# Altium project MCXE31B.PrjPcb (part 2 of 2)

## Sheet 09 ETHERNET_ENET.SchDoc
size 513 x 386 mm
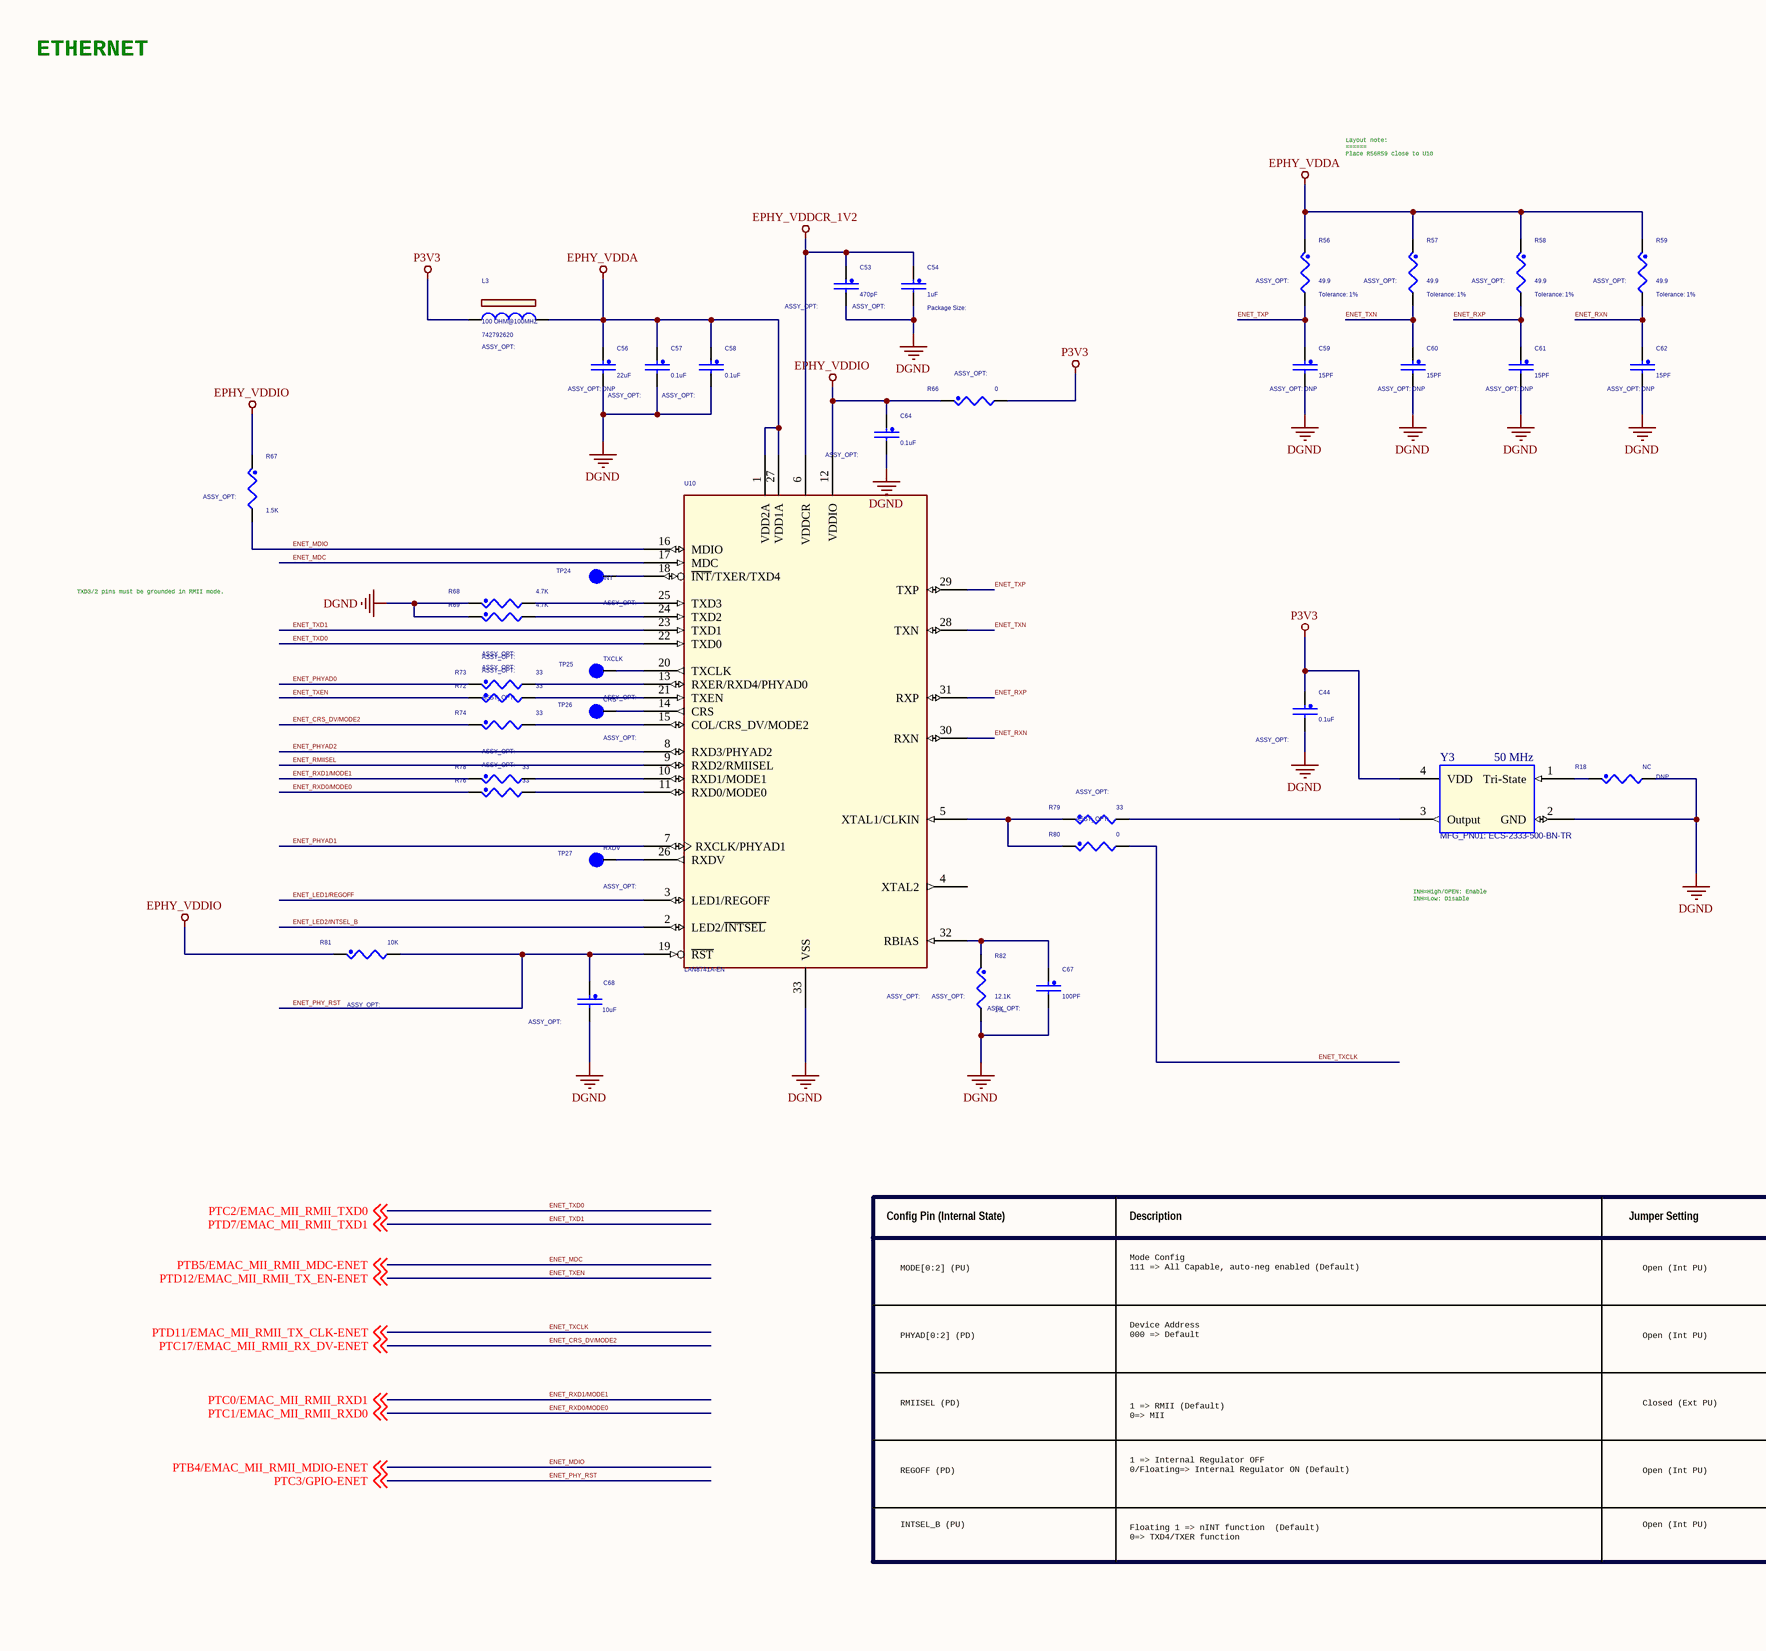
[diagram p10: 09 ETHERNET_ENET.SchDoc, left]
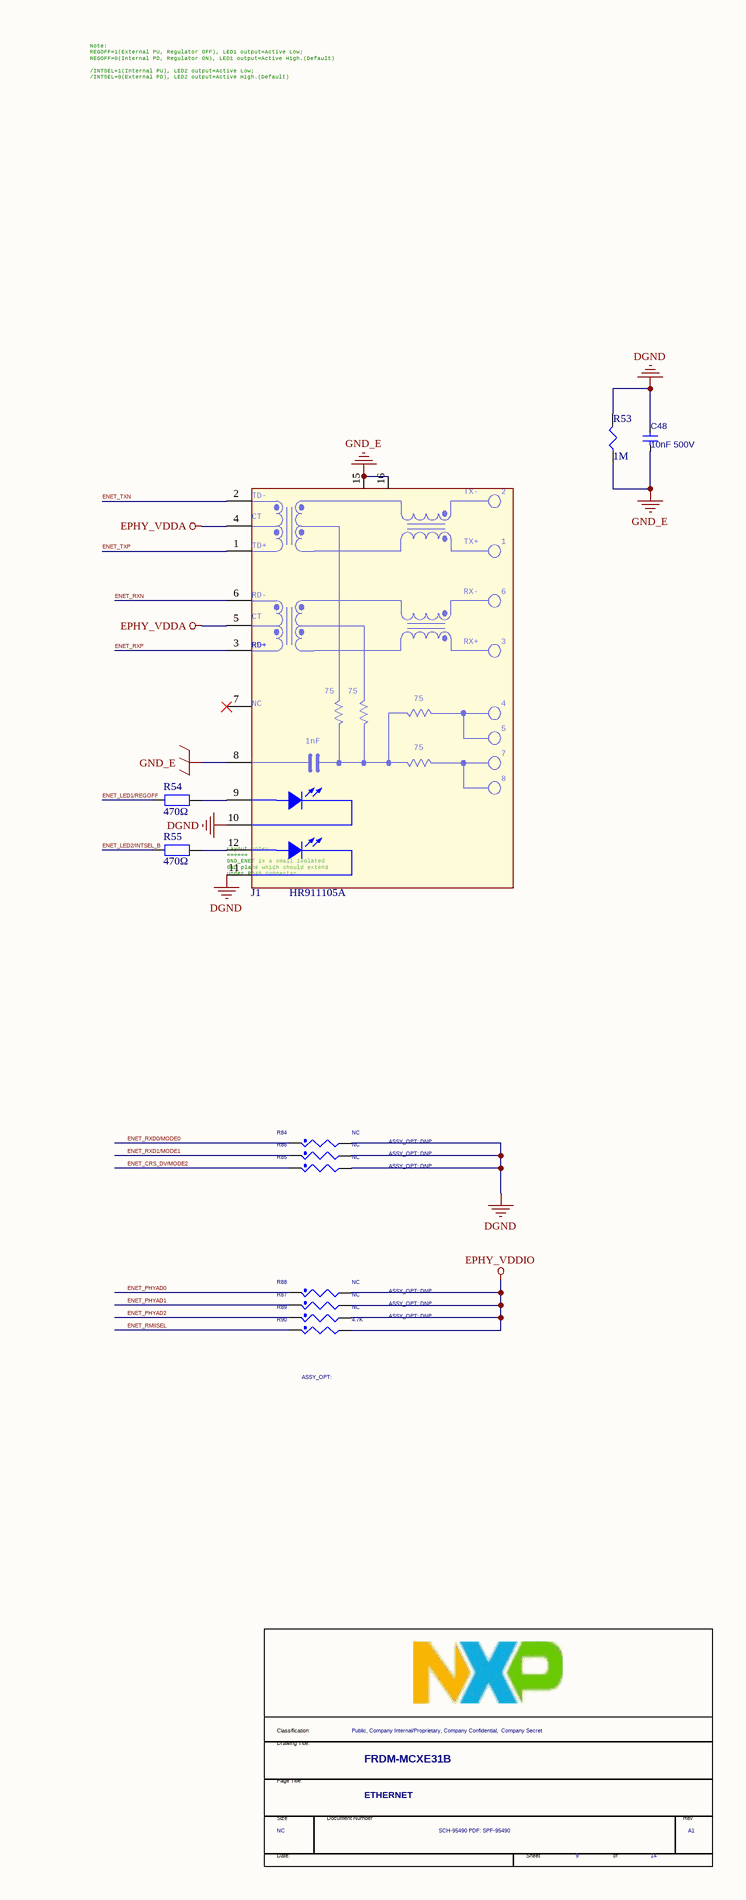
[diagram p11: 09 ETHERNET_ENET.SchDoc, right]

### Parts
(Parts that share a designator on the sheet are numbered #1, #2 ... from top to bottom, then left to right.)
*#7  Title: FRDM-MCXE31B  RevCode: A1  PageTitle: ETHERNET  Page Size: NC  Page Number: 9  Page Count: 14  Doc: SCH-95490 PDF: SPF-95490  Classification: Public, Company Internal/Proprietary, Company Confidential,  Company Secret  (hidden comment: TitleBlock_FS)  (graphical)
C44  0.1uF  [CC0402_25]
C48  10nF 500V  [1210]
C53  470pF  [CC0402_25]
C54  1uF  [CC0402_25]
C56  22uF  ASSY_OPT: DNP  [CC0603_OV]
C57  0.1uF  [CC0402_25]
C58  0.1uF  [CC0402_25]
C59  15PF  ASSY_OPT: DNP  [CC0402_25]
C60  15PF  ASSY_OPT: DNP  [CC0402_25]
C61  15PF  ASSY_OPT: DNP  [CC0402_25]
C62  15PF  ASSY_OPT: DNP  [CC0402_25]
C64  0.1uF  [CC0402_25]
C67  100PF  [CC0402_25]
C68  10uF  [CC0402_25]
J1  HR911105A  [RJ45-HR911105A]
L3  100 OHM@100MHZ  MFG_PN01: 742792620  [L 0603_L]
R18  NC  ASSY_OPT: DNP  [RC0402_25]
R53  1M  [1210]
R54  470Ω  [R0603]
R55  470Ω  [R0603]
R56  49.9  Tolerance: 1%  [RC0402_25]
R57  49.9  Tolerance: 1%  [RC0402_25]
R58  49.9  Tolerance: 1%  [RC0402_25]
R59  49.9  Tolerance: 1%  [RC0402_25]
R66  0  [RC0603_OV]
R67  1.5K  [RC0402_25]
R68  4.7K  [RC0402_25]
R69  4.7K  [RC0402_25]
R72  33  [RC0402_25]
R73  33  [RC0402_25]
R74  33  [RC0402_25]
R76  33  [RC0402_25]
R78  33  [RC0402_25]
R79  33  [RC0402_25]
R80  0  [RC0402_25]
R81  10K  [RC0402_25]
R82  12.1K  Tolerance: 1%  [RC0402_25]
R84  NC  ASSY_OPT: DNP  [RC0402_25]
R85  NC  ASSY_OPT: DNP  [RC0402_25]
R86  NC  ASSY_OPT: DNP  [RC0402_25]
R87  NC  ASSY_OPT: DNP  [RC0402_25]
R88  NC  ASSY_OPT: DNP  [RC0402_25]
R89  NC  ASSY_OPT: DNP  [RC0402_25]
R90  4.7K  [RC0402_25]
TP24  SILK: INT  [TPAD_030]  (hidden comment: TPAD_030)
TP25  SILK: TXCLK  [TPAD_030]  (hidden comment: TPAD_030)
TP26  SILK: CRS  [TPAD_030]  (hidden comment: TPAD_030)
TP27  SILK: RXDV  [TPAD_030]  (hidden comment: TPAD_030)
U10  LAN8741A-EN  [QFN-32-EP(5x5)]
Y3  50 MHz  MFG_PN01: ECS-2333-500-BN-TR  [OSC-SMD_4P-L3.2-W2.5-BL]

### Nets
DGND: C44.2 C48.2 C53.2 C54.2 C56.2 C57.2 C58.2 C59.2 C60.2 C61.2 C62.2 C64.2 C67.2 C68.2 J1.10(CATHODE) J1.11(CATHODE) R18.2 R53.2 R68.1 R69.1 R82.2 R84.2 R85.2 R86.2 U10.33(VSS) Y3.2(GND)
EPHY_VDDA: C56.1 C57.1 C58.1 J1.4(P4) J1.5(P5) L3.2 R56.1 R57.1 R58.1 R59.1 U10.1(VDD2A) U10.27(VDD1A)
EPHY_VDDCR_1V2: C53.1 C54.1 U10.6(VDDCR)
EPHY_VDDIO: C64.1 R66.1 R67.1 R81.1 R87.2 R88.2 R89.2 R90.2 U10.12(VDDIO)
GND_E: C48.1 J1.8(P8) J1.15(P15) J1.16(P16) R53.1
P3V3: C44.1 L3.1 R66.2 Y3.4(VDD)
ENET_CRS_DV/MODE2: R74.1 R85.1 ; off-sheet PTC17/EMAC_MII_RMII_RX_DV-ENET  [also labelled PTC17/EMAC_MII_RMII_RX_DV-ENET]
ENET_LED1/REGOFF: R54.2 U10.3(LED1/REGOFF)
ENET_LED2/INTSEL_B: R55.2 U10.2(LED2/~{INTSEL})
ENET_MDC: U10.17(MDC) ; off-sheet PTB5/EMAC_MII_RMII_MDC-ENET  [also labelled PTB5/EMAC_MII_RMII_MDC-ENET]
ENET_MDIO: R67.2 U10.16(MDIO) ; off-sheet PTB4/EMAC_MII_RMII_MDIO-ENET  [also labelled PTB4/EMAC_MII_RMII_MDIO-ENET]
ENET_PHY_RST: C68.1 R81.2 U10.19(~{RST}) ; off-sheet PTC3/GPIO-ENET  [also labelled PTC3/GPIO-ENET]
ENET_PHYAD0: R73.1 R88.1
ENET_PHYAD1: R87.1 U10.7(RXCLK/PHYAD1)
ENET_PHYAD2: R89.1 U10.8(RXD3/PHYAD2)
ENET_RMIISEL: R90.1 U10.9(RXD2/RMIISEL)
ENET_RXD0/MODE0: R76.1 R84.1 ; off-sheet PTC1/EMAC_MII_RMII_RXD0  [also labelled PTC1/EMAC_MII_RMII_RXD0]
ENET_RXD1/MODE1: R78.1 R86.1 ; off-sheet PTC0/EMAC_MII_RMII_RXD1  [also labelled PTC0/EMAC_MII_RMII_RXD1]
ENET_RXN: C62.1 J1.6(P6) R59.2 U10.30(RXN)
ENET_RXP: C61.1 J1.3(P3) R58.2 U10.31(RXP)
ENET_TXCLK: R80.2 ; off-sheet PTD11/EMAC_MII_RMII_TX_CLK-ENET  [also labelled PTD11/EMAC_MII_RMII_TX_CLK-ENET]
ENET_TXD0: U10.22(TXD0) ; off-sheet PTC2/EMAC_MII_RMII_TXD0  [also labelled PTC2/EMAC_MII_RMII_TXD0]
ENET_TXD1: U10.23(TXD1) ; off-sheet PTD7/EMAC_MII_RMII_TXD1  [also labelled PTD7/EMAC_MII_RMII_TXD1]
ENET_TXEN: R72.1 ; off-sheet PTD12/EMAC_MII_RMII_TX_EN-ENET  [also labelled PTD12/EMAC_MII_RMII_TX_EN-ENET]
ENET_TXN: C60.1 J1.2(P2) R57.2 U10.28(TXN)
ENET_TXP: C59.1 J1.1(P1) R56.2 U10.29(TXP)
NetC67_1: C67.1 R82.1 U10.32(RBIAS)
NetJ1_9: J1.9(ANODE) R54.1
NetJ1_12: J1.12(ANODE) R55.1
NetR18_1: R18.1 Y3.1(Tri-State)
NetR68_2: R68.2 U10.25(TXD3)
NetR69_2: R69.2 U10.24(TXD2)
NetR72_2: R72.2 U10.21(TXEN)
NetR73_2: R73.2 U10.13(RXER/RXD4/PHYAD0)
NetR74_2: R74.2 U10.15(COL/CRS_DV/MODE2)
NetR76_2: R76.2 U10.11(RXD0/MODE0)
NetR78_2: R78.2 U10.10(RXD1/MODE1)
NetR79_1: R79.1 R80.1 U10.5(XTAL1/CLKIN)
NetR79_2: R79.2 Y3.3(Output)
NetTP24_1: TP24.1(Pin1) U10.18(~{INT}/TXER/TXD4)
NetTP25_1: TP25.1(Pin1) U10.20(TXCLK)
NetTP26_1: TP26.1(Pin1) U10.14(CRS)
NetTP27_1: TP27.1(Pin1) U10.26(RXDV)

Not connected (* = marked no-connect by the designer): J1 7(P7)*; U10 4(XTAL2)

### Notes on the sheet
- ETHERNET
- Layout note:
  ======
  Place R56R59 close to U10
- Note:
  REGOFF=1(External PU, Regulator OFF), LED1 output=Active Low;
  REGOFF=0(Internal PD, Regulator ON), LED1 output=Active High.(Default)
  /INTSEL=1(Internal PU), LED2 output=Active Low;
  /INTSEL=0(External PD), LED2 output=Active High.(Default)
- TXD3/2 pins must be grounded in RMII mode.
- INH=High/OPEN: Enable
  INH=Low: Disable
- (near J1) Layout note:
  ======
  GND_ENET is a small isolated
  GND plane which should extend
  under RJ45 connector
- Config Pin (Internal State)
- Description
- Jumper Setting
- MODE[0:2] (PU)
- Mode Config
  111 => All Capable, auto-neg enabled (Default)
- Open (Int PU)
- PHYAD[0:2] (PD)
- Device Address
  000 => Default
- RMIISEL (PD)
- 1 => RMII (Default)
  0=> MII
- Closed (Ext PU)
- REGOFF (PD)
- 1 => Internal Regulator OFF
  0/Floating=> Internal Regulator ON (Default)
- INTSEL_B (PU)
- Floating 1 => nINT function  (Default)
  0=> TXD4/TXER function
- (in symbol HR911105A) TX-; TD-; CT; TX+; TD+; RX-; RD-; RX+; RD+; 75; NC; 1nF
- (in symbol TitleBlock_FS) Classification:; Drawing Title:; Page Title:; Size; Document Number; Rev; Date:; Sheet; of

### Library data of the parts
*#7 = TitleBlock_FS: as *#4 on sheet 06 MCU_PORT; Page Create Date: March  8, 1995
C44 C57 C58 C64 = CAP_NP: CAP CER 0.1UF 16V 10% X7R 0402; CLASS: DISCRETE; Temp Range: -55C to +125C; SIGNAL_MODEL: DEFAULT_CAPACITOR_100000pF_2_1; AGILE_PN: 150-75182; MFG_NAME01: Samsung Electro-Mechanics; MFG_PN01: CL05B104KO5NNNC; CAD_APPROVED: Yes; FPLIST: CC0402_25,CC0402_HD,0402_CC,CAPC0402_L,cc0402_lamp3; Temp_Range: -55癈 to +85癈; 3D_Mechanical_Footprint_File: http://fcl.am.freescale.net/ALLEGRO/step/cc0402_25.STEP; Rated Voltage: 16V; Tolerance: 10%; ROHS: NULL; HEIGHT: 0.635mm; TOL: 10%; VOLTAGE: 16V
C48 = CAP
C53 = CAP_NP: CAP CER 470pF 50V 5% C0G 0402; CLASS: DISCRETE; AGILE_PN: 150-30004; FPLIST: CC0402_25,CC0402_HD,0402_CC,capc0402_l; CAD_APPROVED: YES; Temp Range: -55C to +125C; MFG_NAME01: MURATA; MFG_PN01: GRM1555C1H471JA01D; Package Size: 0402; HEIGHT: 0.55; Tolerance: 5%; Rated Voltage: 50V; ROHS: NULL
C54 = CAP_NP: CAP CER 1.0uF 16V 10% X6S 0402; CLASS: DISCRETE; MFG_PN01: GRM155C81C105KE11D; MFG_NAME01: MURATA; Temp Range: -55C to +105C; CAD_APPROVED: Yes; FPLIST: CC0402_25,CC0402_HD,0402_CC,capc0402_l; AGILE_PN: 150-80262; VOLTAGE: 16V; ROHS: Yes; Rated Voltage: 16V; Tolerance: 10%; HEIGHT: 0.55
C56 = CAP_NP: CAP CER 22uF 10V 20% X5R 0603; CLASS: DISCRETE; AGILE_PN: 150-79530; FPLIST: CC0603_OV,CC0603,0603_cc_tol; CAD_APPROVED: Yes; Temp Range: -55°C to 85°C; MFG_NAME01: SAMSUNG; MFG_PN01: CL10A226MP7LUNC; Package Size: 0603 [1608 Metric]; HEIGHT: 1.05mm; Package Type: SMD/SMT; Tolerance: 20%; Rated Voltage: 10V; ROHS: NULL; 3D_Mechanical_Footprint_File: http://fcl.am.freescale.net/ALLEGRO/step/cc0603_ov.STEP
C59-C62 = CAP_NP: CAP CER 15pF 50V 5% C0G 0402; CLASS: DISCRETE; AGILE_PN: 150-81667; FPLIST: CC0402_25,CC0402_HD,0402_CC,capc0402_l; CAD_APPROVED: Yes; Temp Range: -55°C ~ 125°C; MFG_NAME01: Murata Electronics; MFG_PN01: GJM1555C1H150JB01D; Package Size: 0402 (1005 Metric); HEIGHT: 0.55; Package Type: Surface Mount, MLCC; Tolerance: 5%; Rated Voltage: 50V; ROHS: Yes; 3D_Mechanical_Footprint_File: http://fcl.am.freescale.net/ALLEGRO/step/cc0402_25.STEP
C67 = CAP_NP: CAP CER 100pF 16V 10% X7R 0402; CLASS: DISCRETE; MFG_PN01: 0402YC101KAT2A; MFG_NAME01: AVX; Temp Range: -55C to +125C; CAD_APPROVED: Yes; FPLIST: CC0402_25,CC0402_HD,0402_CC,capc0402_l; AGILE_PN: 150-79188; ROHS: Yes; Rated Voltage: 16V; Tolerance: 10%; Package Type: 7" Reel; HEIGHT: 0.56; Package Size: 0402
C68 = CAP_NP: as C15 on sheet 05 MCU_C; Package Size: 0603; HEIGHT: 1; Tolerance: 20%; Rated Voltage: 25V; ROHS: Yes
J1 = HR911105A: REF: J00-0061NL; DESIG: 10/100 base TX LXT971A; BOI: RJ45; FAB: PULSE; DEV: CON_PULSE_J00-61; RoHS: YES; VAL: J00-0061NL
L3 = INDUCTOR_FERRITE: IND FER BEAD 100 OHM@100MHz 0.5A 25% AEC-Q200 0603; CLASS: DISCRETE; AGILE_PN: 180-10207; CAD_APPROVED: Yes; Temp Range: -55°C to 125°C; MFG_NAME01: WURTH ELEKTRONIK EISOS GMBH & CO. KG (ELECTRONIC & ELECTROMEHANICAL COMP); Package Size: 0603; HEIGHT: 1mm; ROHS: NULL; 3D_Mechanical_Footprint_File: http://fcl.am.freescale.net/ALLEGRO/step/ind_1p8x1mm_sm.step
R18 R80 = RES: RES MF ZERO OHM 1/10W -- 0603; CLASS: DISCRETE; AGILE_PN: 470-80866; FPLIST: RC0603_OV,RC0603,R603-X2,r603-x2_b,0603_CC,IND_0603HP_NSP,CC0603_OV_NSP; CAD_APPROVED: Yes; Temp Range: –55 °C to +155 °C; MFG_NAME01: VISHAY; MFG_PN01: CRCW06030000Z0EAC; HEIGHT: 0.6; ROHS: NULL
R53 = R
R54 R55 = R: 贴片电阻; 版权归属: 源创客; BOM名称: 贴片电阻; 学习资源: www.ooocke.com
R56-R59 = RES: RES MF 49.9 OHM 1/16W 1% 0402; CLASS: DISCRETE; MFG_PN01: CR0402-FX-49R9GLF; MFG_NAME01: BOURNS; CAD_APPROVED: Yes; FPLIST: RC0402_25,RC0402_HD,0402_CC; AGILE_PN: 470-75360; ROHS: Yes; HEIGHT: 0.4
R66 = RES: RES MF ZERO OHM 1/10W -- 0603; CLASS: DISCRETE; MFG_PN01: CRCW06030000Z0EAC; MFG_NAME01: VISHAY; Temp Range: –55 °C to +155 °C; CAD_APPROVED: Yes; FPLIST: RC0603_OV,RC0603,R603-X2,r603-x2_b,0603_CC,IND_0603HP_NSP,CC0603_OV_NSP; AGILE_PN: 470-80866; ROHS: NULL; HEIGHT: 0.6
R67 = RES: RES MF 1.5K 1/16W 1% 0402; CLASS: DISCRETE; MFG_PN01: CR0402-FX-1501GLF; MFG_NAME01: BOURNS; CAD_APPROVED: Yes; FPLIST: RC0402_25,RC0402_HD,0402_CC; AGILE_PN: 470-80487; ROHS: Yes; Tolerance: 1%; HEIGHT: 0.4
R68 R86 R87 R89 = RES: RES MF 4.7K 1/16W 5% 0402; CLASS: DISCRETE; Pkg: 0402; AGILE_PN: 470-75626; FPLIST: RC0402_25,RC0402_HD,0402_CC,RC0402_X2; CAD_APPROVED: Yes; MFG_NAME01: BOURNS; MFG_PN01: CR0402-JW-472GLF; HEIGHT: 0.41; Tolerance: 5%; ROHS: NULL
R69 R84 R85 R88 R90 = RES: RES MF 4.7K 1/16W 5% 0402; CLASS: DISCRETE; MFG_PN01: CR0402-JW-472GLF; MFG_NAME01: BOURNS; CAD_APPROVED: Yes; FPLIST: RC0402_25,RC0402_HD,0402_CC,RC0402_X2; AGILE_PN: 470-75626; Pkg: 0402; ROHS: NULL; Tolerance: 5%; HEIGHT: 0.41
R72 R76 R79 = RES: RES MF 33.0 OHM 1/16W 1% 0402; CLASS: DISCRETE; MFG_PN01: CRCW040233R0FKEDC; MFG_NAME01: VISHAY; CAD_APPROVED: Yes; FPLIST: RC0402_25,RC0402_HD,RC0402_X2,0402_CC; AGILE_PN: 470-75790; ROHS: Yes; Tolerance: 1%; HEIGHT: 0.4
R73 R74 R78 = RES: RES MF 33.0 OHM 1/16W 1% 0402; CLASS: DISCRETE; AGILE_PN: 470-75790; FPLIST: RC0402_25,RC0402_HD,RC0402_X2,0402_CC; CAD_APPROVED: Yes; MFG_NAME01: VISHAY; MFG_PN01: CRCW040233R0FKEDC; HEIGHT: 0.4; Tolerance: 1%; ROHS: Yes
R81 = RES: RES MF 10K 1/16W 5% 0402; CLASS: DISCRETE; MFG_PN01: CR0402-JW-103GLF; MFG_NAME01: BOURNS; CAD_APPROVED: Yes; FPLIST: RC0402_25,RC0402_HD,0402_CC; AGILE_PN: 470-75557; ROHS: NULL; Tolerance: 5%; HEIGHT: 0.4MM
R82 = RES: RES MF 12.1K 1/16W 1% 0402; CLASS: DISCRETE; AGILE_PN: 470-76098; FPLIST: RC0402_25,RC0402_HD,0402_CC; CAD_APPROVED: Yes; MFG_NAME01: BOURNS; MFG_PN01: CR0402-FX-1212GLF; HEIGHT: 0.4; ROHS: Yes
TP24 TP26 = TESTLOOP: TEST POINT PAD 30MIL DIA SMT, NO PART TO ORDER; CLASS: IO; CAD_APPROVED: Yes; MFG_PN01: NOTACOMPONENT; AGILE_PN: 211-76642; HEIGHT: 0.1; ROHS: Yes; MFG_NAME01: NOTACOMPONENT; 3D_Mechanical_Footprint_File: http://fcl.am.freescale.net/ALLEGRO/step/tpad_030.STEP
TP25 TP27 = TESTLOOP: TEST POINT PAD 30MIL DIA SMT, NO PART TO ORDER; CLASS: IO; AGILE_PN: 211-76642; MFG_NAME01: NOTACOMPONENT; CAD_APPROVED: Yes; 3D_Mechanical_Footprint_File: http://fcl.am.freescale.net/ALLEGRO/step/tpad_030.STEP; MFG_PN01: NOTACOMPONENT; ROHS: Yes; HEIGHT: 0.1
U10 = LAN8710: IC XCVR ETHERNET PHY MII/RMII 1.8-3.3V SQFN32; AGILE_PN: 312-83484; CAD_APPROVED: Yes; Temp Range: -0C to +70C; MFG_NAME01: Microchip Technology; CLASS: IC; Package Size: SQFN-32; HEIGHT: 1; Supply Voltage: 1.8-3.3V; ROHS: Yes; MFG_PN01: LAN8741A-EN; 3D_Mechanical_Footprint_File: http://fcl.am.freescale.net/ALLEGRO/step/qfn32ep.STEP
Y3 = OSC_ASFL: OSC XO 50MHZ 3.3V SMD; CLASS: IC; PCB Footprint: osc4_3p2x2p5_sm; MFG_NAME01: ECS INC. INTERNATIONAL; Temp Range: -40  °C + 85 °C; CAD_APPROVED: YES; AGILE_PN: 230-78687; ROHS: YES; HEIGHT: 1; Package Size: 3.2 mm x 2.5 mm

## Sheet 10 CAN.SchDoc
size 513 x 386 mm
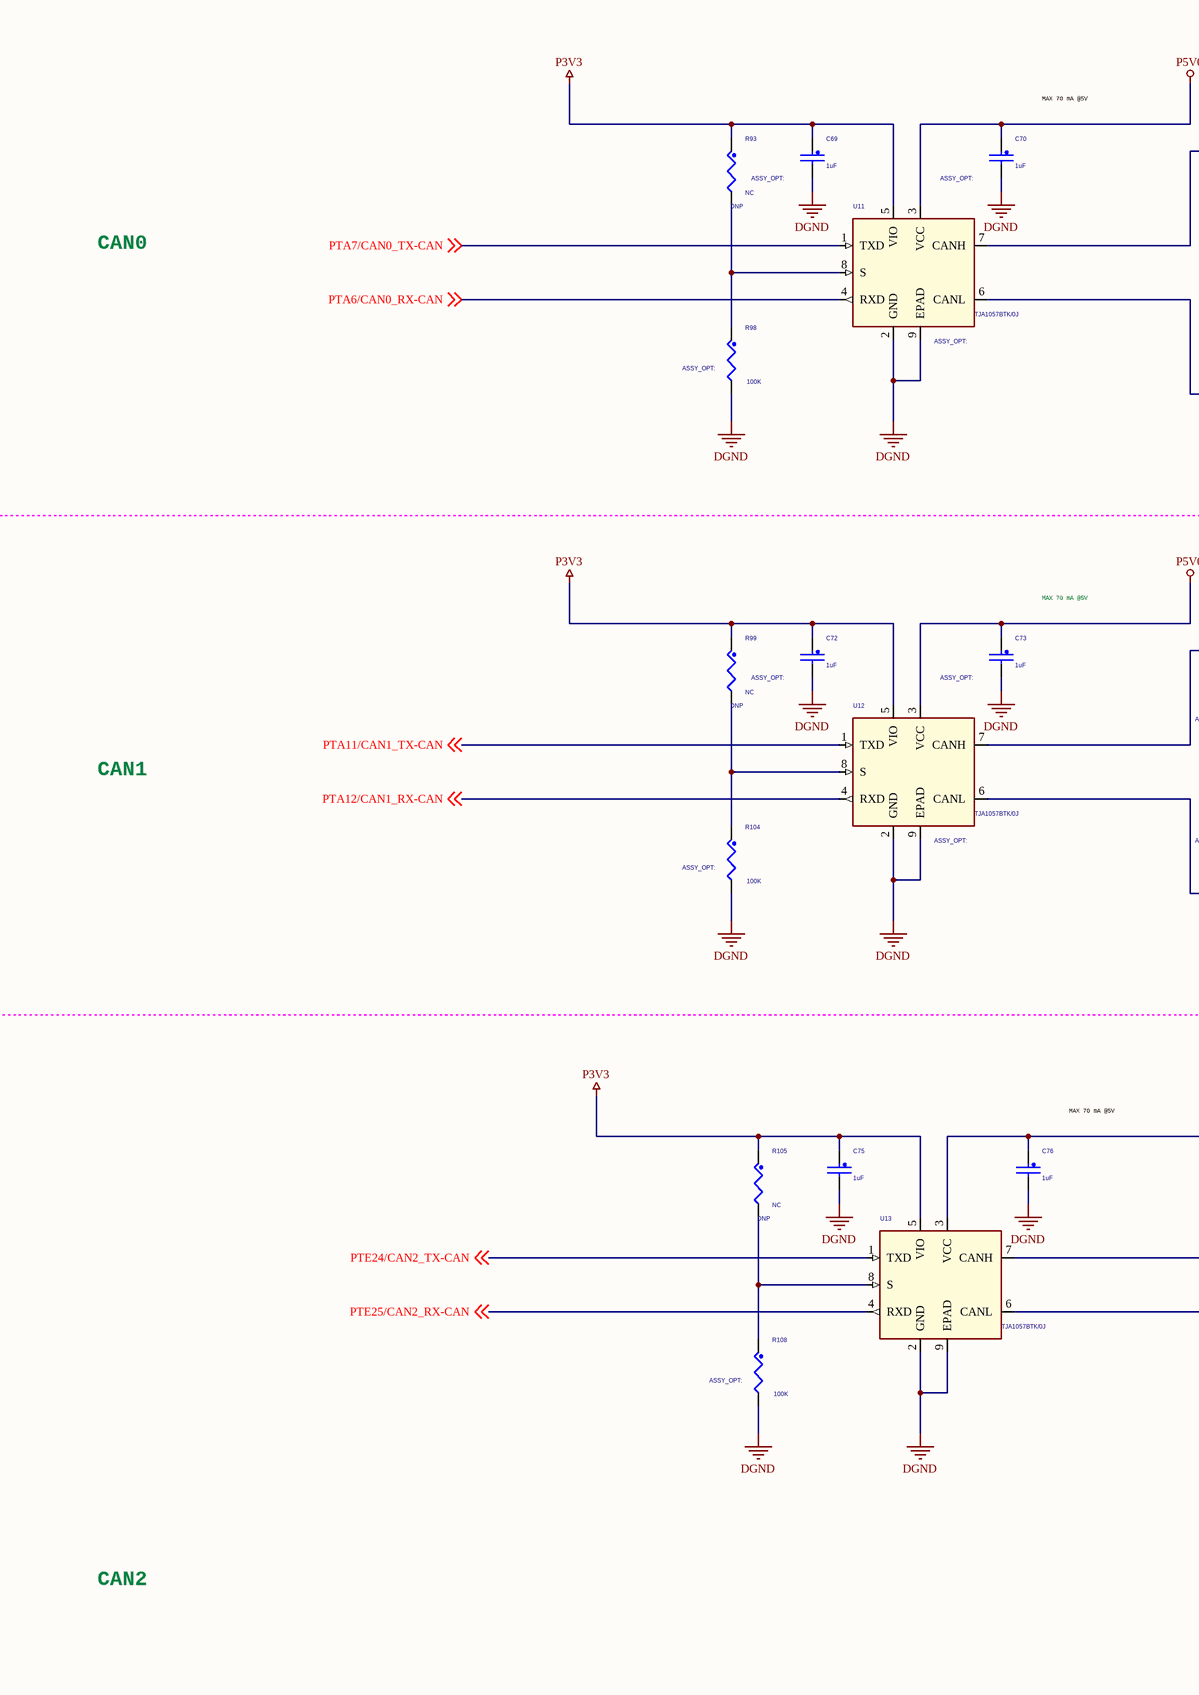
[diagram p12: 10 CAN.SchDoc, left]
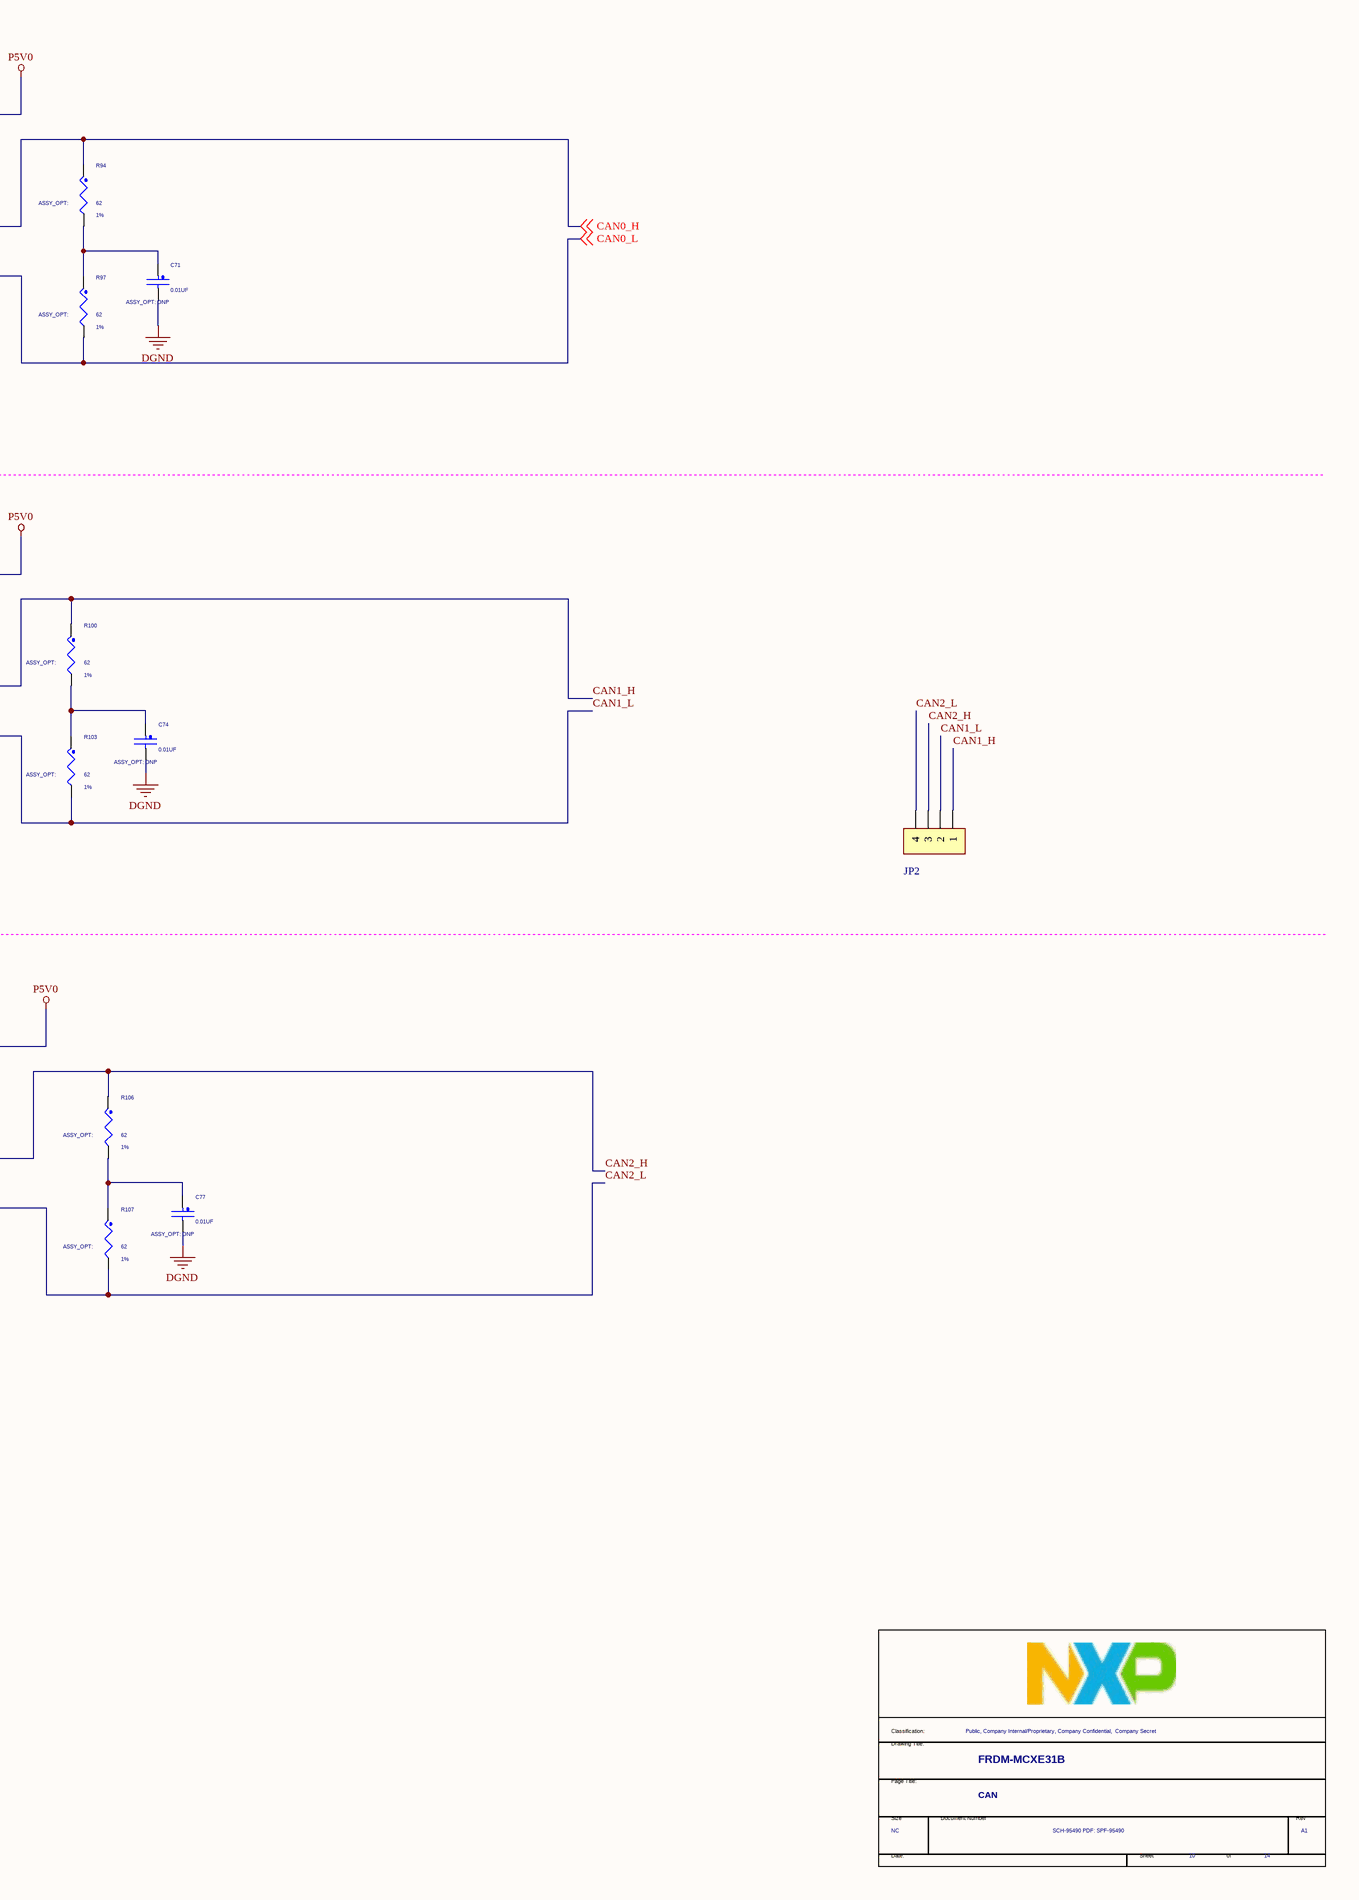
[diagram p13: 10 CAN.SchDoc, right]

### Parts
(Parts that share a designator on the sheet are numbered #1, #2 ... from top to bottom, then left to right.)
*#8  Title: FRDM-MCXE31B  RevCode: A1  PageTitle: CAN  Page Size: NC  Page Number: 10  Page Count: 14  Doc: SCH-95490 PDF: SPF-95490  Classification: Public, Company Internal/Proprietary, Company Confidential,  Company Secret  (hidden comment: TitleBlock_FS)  (graphical)
C69  1uF  [CC0402_25]
C70  1uF  [CC0402_25]
C71  0.01UF  ASSY_OPT: DNP  [CC0402_25]
C72  1uF  [CC0402_25]
C73  1uF  [CC0402_25]
C74  0.01UF  ASSY_OPT: DNP  [CC0402_25]
C75  1uF  [CC0402_25]
C76  1uF  [CC0402_25]
C77  0.01UF  ASSY_OPT: DNP  [CC0402_25]
JP2  HDR-1X4  [KF128-3.81-4P]  (value not drawn)
R93  NC  ASSY_OPT: DNP  [RC0402_25]
R94  62  Tolerance: 1%  [RC0805_OV]
R97  62  Tolerance: 1%  [RC0805_OV]
R98  100K  [RC0402_25]
R99  NC  ASSY_OPT: DNP  [RC0402_25]
R100  62  Tolerance: 1%  [RC0805_OV]
R103  62  Tolerance: 1%  [RC0805_OV]
R104  100K  [RC0402_25]
R105  NC  ASSY_OPT: DNP  [RC0402_25]
R106  62  Tolerance: 1%  [RC0805_OV]
R107  62  Tolerance: 1%  [RC0805_OV]
R108  100K  [RC0402_25]
U11  MFG_PN01: TJA1057BTK/0J  [son8_0p65_3p15x3p15]  (hidden comment: TJA1057BTK)
U12  MFG_PN01: TJA1057BTK/0J  [son8_0p65_3p15x3p15]  (hidden comment: TJA1057BTK)
U13  MFG_PN01: TJA1057BTK/0J  [son8_0p65_3p15x3p15]  (hidden comment: TJA1057BTK)

### Nets
DGND: C69.2 C70.2 C71.2 C72.2 C73.2 C74.2 C75.2 C76.2 C77.2 R98.2 R104.2 R108.2 U11.2(GND) U11.9(EPAD) U12.2(GND) U12.9(EPAD) U13.2(GND) U13.9(EPAD)
P3V3: C69.1 C72.1 C75.1 R93.1 R99.1 R105.1 U11.5(VIO) U12.5(VIO) U13.5(VIO)
P5V0: C70.1 C73.1 C76.1 U11.3(VCC) U12.3(VCC) U13.3(VCC)
CAN0_H: R94.1 U11.7(CANH) ; off-sheet CAN0_H
CAN0_L: R97.2 U11.6(CANL) ; off-sheet CAN0_L
CAN1_H: JP2.1 R100.1 U12.7(CANH)
CAN1_L: JP2.2 R103.2 U12.6(CANL)
CAN2_H: JP2.3 R106.1 U13.7(CANH)
CAN2_L: JP2.4 R107.2 U13.6(CANL)
PTA6/CAN0_RX-CAN: U11.4(RXD) ; off-sheet PTA6/CAN0_RX-CAN  [project net PTA6]
PTA7/CAN0_TX-CAN: U11.1(TXD) ; off-sheet PTA7/CAN0_TX-CAN  [project net PTA7]
PTA11/CAN1_TX-CAN: U12.1(TXD) ; off-sheet PTA11/CAN1_TX-CAN  [project net PTA11]
PTA12/CAN1_RX-CAN: U12.4(RXD) ; off-sheet PTA12/CAN1_RX-CAN  [project net PTA12]
PTE24/CAN2_TX-CAN: U13.1(TXD) ; off-sheet PTE24/CAN2_TX-CAN  [project net PTE24]
PTE25/CAN2_RX-CAN: U13.4(RXD) ; off-sheet PTE25/CAN2_RX-CAN  [project net PTE25]
NetC71_1: C71.1 R94.2 R97.1
NetC74_1: C74.1 R100.2 R103.1
NetC77_1: C77.1 R106.2 R107.1
NetR93_2: R93.2 R98.1 U11.8(S)
NetR99_2: R99.2 R104.1 U12.8(S)
NetR105_2: R105.2 R108.1 U13.8(S)

### Notes on the sheet
- MAX 70 mA @5V
- CAN0
- CAN1
- CAN2
- (in symbol TitleBlock_FS) Classification:; Drawing Title:; Page Title:; Size; Document Number; Rev; Date:; Sheet; of

### Library data of the parts
*#8 = TitleBlock_FS: Variant Name: <Core Design>; OrgAddr2: Austin, TX 78735-8598; OrgAddr1: 6501 William Cannon Drive West; OrgName: NXP Semiconductors; Classification: Company Internal/Proprietary; Page Create Date: March  8, 1995
C69 C70 C75 = CAP_NP: CAP CER 1.0uF 16V 10% X6S 0402; CLASS: DISCRETE; Temp Range: -55C to +105C; FPLIST: CC0402_25,CC0402_HD,0402_CC,capc0402_l; CAD_APPROVED: Yes; MFG_PN01: GRM155C81C105KE11D; MFG_NAME01: MURATA; AGILE_PN: 150-80262; SIGNAL_MODEL: DEFAULT_CAPACITOR_1e+06pF_2_1; Temp_Range: -55癈 to +125癈; Rated Voltage: 16V; VOLTAGE: 16V; HEIGHT: 0.55; ROHS: Yes; Tolerance: 10%
C71 = CAP_NP: CAP CER 0.01UF 50V 10% X7R 0402; CLASS: DISCRETE; AGILE_PN: 150-30114; FPLIST: CC0402_25,CC0402_HD,0402_CC,capc0402_l; CAD_APPROVED: Yes; Temp Range: -55C to +125C; MFG_NAME01: MURATA; MFG_PN01: GRM155R71H103KA88D; HEIGHT: 0.55MM; Tolerance: 10%; Rated Voltage: 50V; ROHS: NULL
C72 C73 C76 = CAP_NP: CAP CER 1.0uF 16V 10% X6S 0402; CLASS: DISCRETE; Temp_Range: -55癈 to +125癈; SIGNAL_MODEL: DEFAULT_CAPACITOR_1e+06pF_2_1; AGILE_PN: 150-80262; MFG_NAME01: MURATA; MFG_PN01: GRM155C81C105KE11D; CAD_APPROVED: Yes; FPLIST: CC0402_25,CC0402_HD,0402_CC,capc0402_l; Temp Range: -55C to +105C; Tolerance: 10%; ROHS: Yes; HEIGHT: 0.55; VOLTAGE: 16V; Rated Voltage: 16V
C74 C77 = CAP_NP: CAP CER 0.01UF 50V 10% X7R 0402; CLASS: DISCRETE; MFG_PN01: GRM155R71H103KA88D; MFG_NAME01: MURATA; Temp Range: -55C to +125C; CAD_APPROVED: Yes; FPLIST: CC0402_25,CC0402_HD,0402_CC,capc0402_l; AGILE_PN: 150-30114; ROHS: NULL; Rated Voltage: 50V; Tolerance: 10%; HEIGHT: 0.55MM
JP2 = Header 4: 4P接插件; BOM名称: 4P接插件
R93 R105 = RES: RES MF 10K 1/16W 5% 0402; CLASS: DISCRETE; FPLIST: RC0402_25,RC0402_HD,0402_CC; CAD_APPROVED: Yes; MFG_PN01: CR0402-JW-103GLF; MFG_NAME01: BOURNS; AGILE_PN: 470-75557; SIGNAL_MODEL: DEFAULT_RESISTOR_10000OHM_2_1; Temp_Range: ?5 癈 to +155 癈; HEIGHT: 0.4MM; TOL: 5%; ROHS: NULL; Tolerance: 5%
R94 R100 R103 = RES: RES MF 62 OHM 1/4W 1% AEC-Q200 0805; CLASS: DISCRETE; MFG_PN01: SG73P2ATTD62R0F; MFG_NAME01: KOA SPEER; Temp Range: -55 °C to +155 °C; CAD_APPROVED: Yes; FPLIST: RC0805_OV,RC0805,0805_CC; AGILE_PN: 470-83214; 3D_Mechanical_Footprint_File: http://fcl.am.freescale.net/ALLEGRO/step/RC0805_OV.STEP; ROHS: Yes; HEIGHT: 0.60; Package Size: 0805 (2012 Metric)
R97 R106 R107 = RES: RES MF 62 OHM 1/4W 1% AEC-Q200 0805; CLASS: DISCRETE; AGILE_PN: 470-83214; FPLIST: RC0805_OV,RC0805,0805_CC; CAD_APPROVED: Yes; Temp Range: -55 °C to +155 °C; MFG_NAME01: KOA SPEER; MFG_PN01: SG73P2ATTD62R0F; Package Size: 0805 (2012 Metric); HEIGHT: 0.60; ROHS: Yes; 3D_Mechanical_Footprint_File: http://fcl.am.freescale.net/ALLEGRO/step/RC0805_OV.STEP
R98 R108 = RES: RES MF 100K 1/16W 1% 0402; CLASS: DISCRETE; MFG_PN01: CRCW0402100KFKEDC; MFG_NAME01: VISHAY INTERTECHNOLOGY; CAD_APPROVED: Yes; FPLIST: RC0402_25,RC0402_HD,0402_CC; AGILE_PN: 470-76240; ROHS: Yes; Tolerance: 1%; HEIGHT: 0.4
R99 = RES: RES MF 10K 1/16W 5% 0402; CLASS: DISCRETE; Temp_Range: ?5 癈 to +155 癈; SIGNAL_MODEL: DEFAULT_RESISTOR_10000OHM_2_1; AGILE_PN: 470-75557; MFG_NAME01: BOURNS; MFG_PN01: CR0402-JW-103GLF; CAD_APPROVED: Yes; FPLIST: RC0402_25,RC0402_HD,0402_CC; Tolerance: 5%; ROHS: NULL; TOL: 5%; HEIGHT: 0.4MM
R104 = RES: RES MF 100K 1/16W 1% 0402; CLASS: DISCRETE; AGILE_PN: 470-76240; FPLIST: RC0402_25,RC0402_HD,0402_CC; CAD_APPROVED: Yes; MFG_NAME01: VISHAY INTERTECHNOLOGY; MFG_PN01: CRCW0402100KFKEDC; HEIGHT: 0.4; Tolerance: 1%; ROHS: Yes
U11 U12 = TJA1051TK_3_HVSON8: IC XCVR CAN 4.5-5.5V AEC-Q100 HVSON8; MFG_NAME01: NXP Semiconductor; CAD_APPROVED: Yes; Supply Voltage: 4.5 V to 5.5 V; AGILE_PN: 312-10381; CLASS: IC; 3D_Mechanical_Footprint_File: http://fcl.am.freescale.net/ALLEGRO/step/son8_0p65_3p15x3p15.STEP; ROHS: NULL; HEIGHT: 1mm; Package Size: HVSON-8
U13 = TJA1051TK_3_HVSON8: IC XCVR CAN 4.5-5.5V AEC-Q100 HVSON8; AGILE_PN: 312-10381; Supply Voltage: 4.5 V to 5.5 V; CAD_APPROVED: Yes; MFG_NAME01: NXP Semiconductor; CLASS: IC; Package Size: HVSON-8; HEIGHT: 1mm; ROHS: NULL; 3D_Mechanical_Footprint_File: http://fcl.am.freescale.net/ALLEGRO/step/son8_0p65_3p15x3p15.STEP

## Sheet 12 SWITCH & LED.SchDoc
size 513 x 386 mm
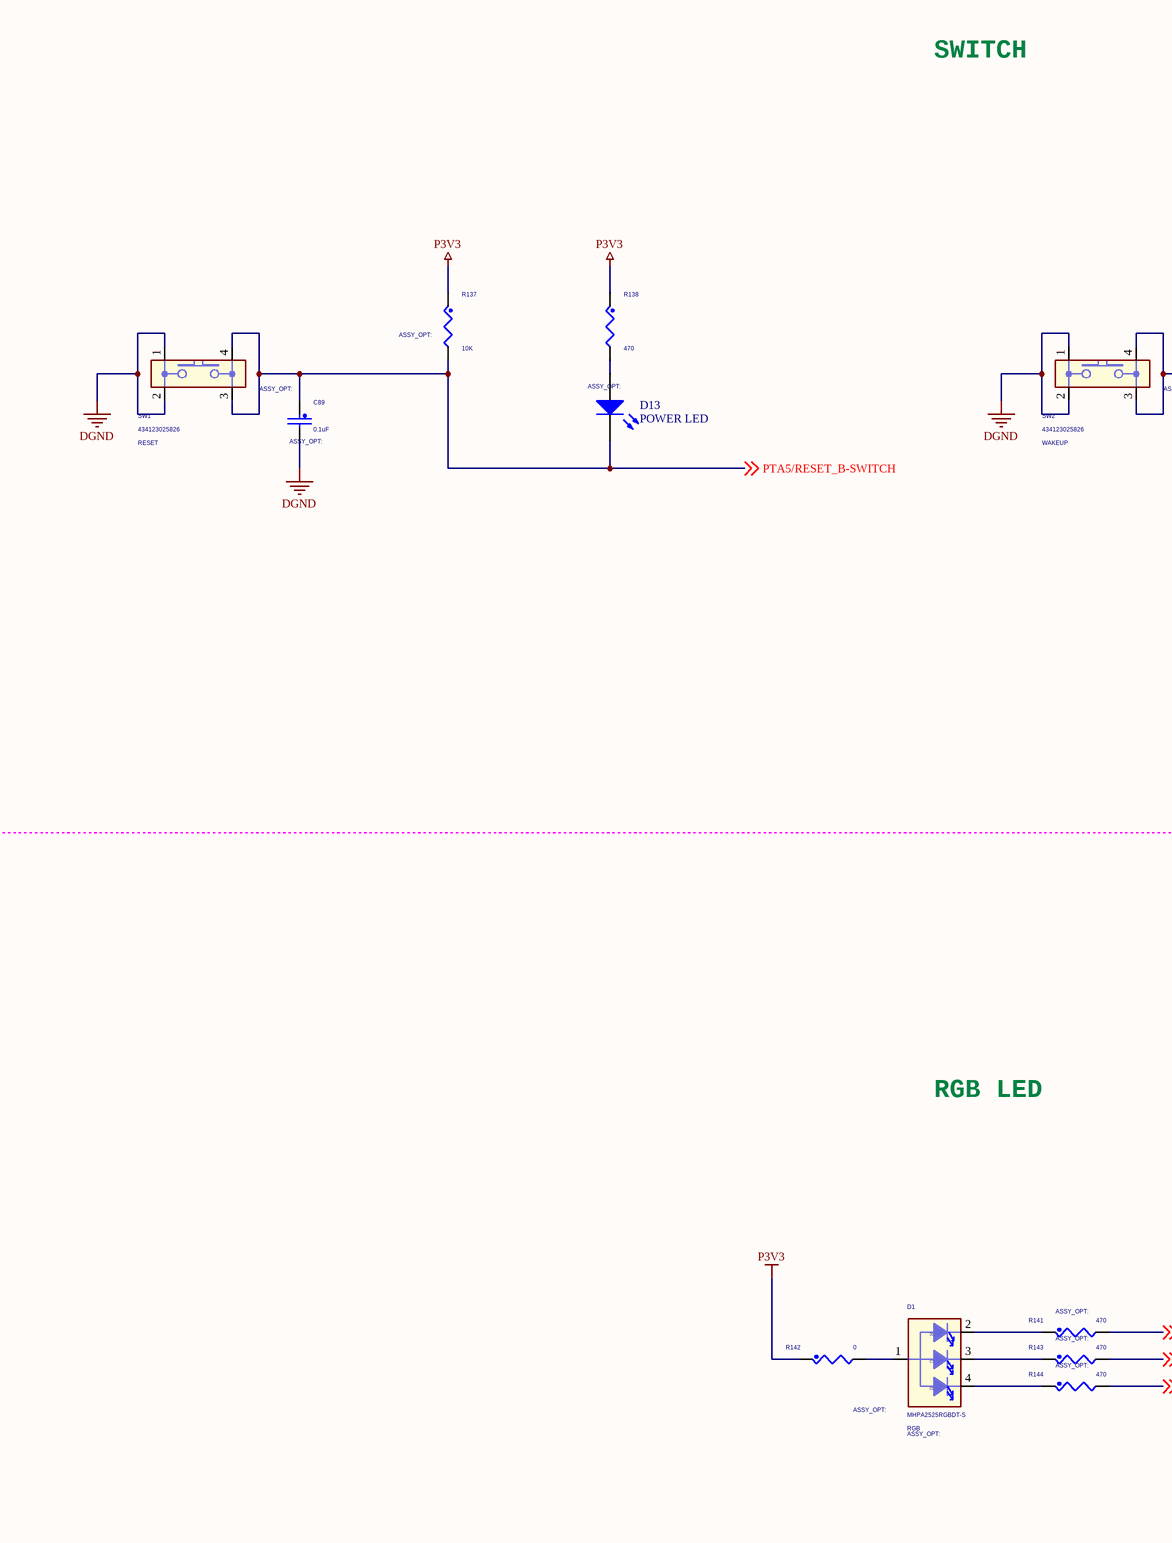
[diagram p14: 12 SWITCH & LED.SchDoc, left]
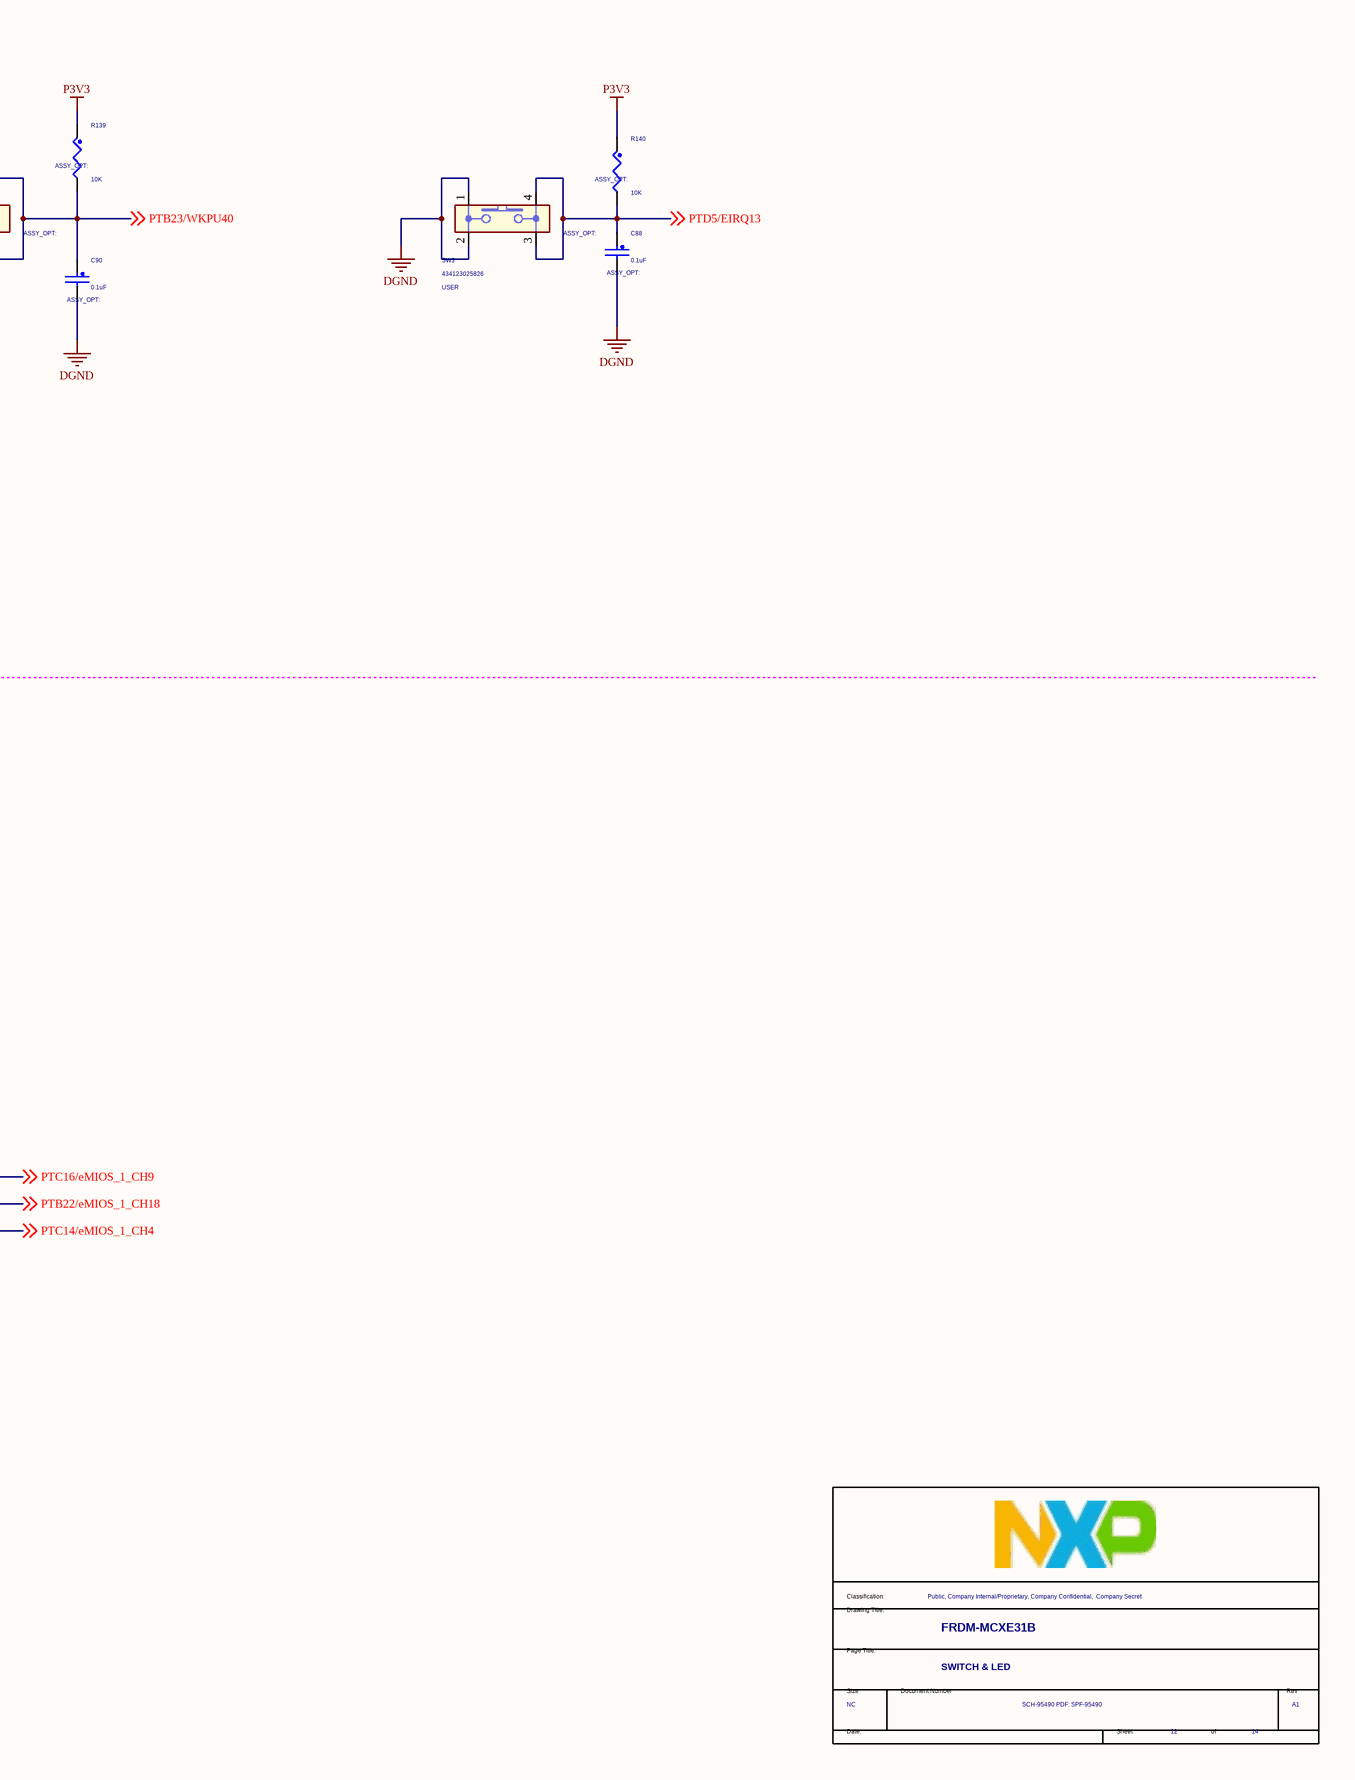
[diagram p15: 12 SWITCH & LED.SchDoc, right]

### Parts
(Parts that share a designator on the sheet are numbered #1, #2 ... from top to bottom, then left to right.)
*#9  Title: FRDM-MCXE31B  RevCode: A1  PageTitle: SWITCH & LED  Page Size: NC  Page Number: 12  Page Count: 14  Doc: SCH-95490 PDF: SPF-95490  Classification: Public, Company Internal/Proprietary, Company Confidential,  Company Secret  (hidden comment: TitleBlock_FS)  (graphical)
C88  0.1uF  [CC0402_25]
C89  0.1uF  [CC0402_25]
C90  0.1uF  [CC0402_25]
D1  MFG_PN01: MHPA2525RGBDT-S  [led4_2p7x2p6_sm]  (hidden comment: RGB)
D13  POWER LED  [LED 0603R]
R137  10K  [RC0402_25]
R138  470  [RC0402_25]
R139  10K  [RC0402_25]
R140  10K  [RC0402_25]
R141  470  [RC0402_25]
R142  0  [RC0603_OV]
R143  470  [RC0402_25]
R144  470  [RC0402_25]
SW1  SILK: RESET  MFG_PN01: 434123025826  [SW-SMD_4P-L5.1-W5.1-P3.70-LS6.5-TL_H1.5]  (hidden comment: SW SPST NO)
SW2  MFG_PN01: 434123025826  SILK: WAKEUP  [SW-SMD_4P-L5.1-W5.1-P3.70-LS6.5-TL_H1.5]  (hidden comment: SW SPST NO)
SW3  SILK: USER  MFG_PN01: 434123025826  [SW-SMD_4P-L5.1-W5.1-P3.70-LS6.5-TL_H1.5]  (hidden comment: SW SPST NO)

### Nets
DGND: C88.2 C89.2 C90.2 SW1.1 SW1.2 SW2.1 SW2.2 SW3.1 SW3.2
P3V3: R137.1 R138.1 R139.1 R140.1 R142.1
PTA5/RESET_B-SWITCH: C89.1 D13.2(K) R137.2 SW1.3 SW1.4 ; off-sheet PTA5/RESET_B-SWITCH  [project net PTA5]
PTB22/eMIOS_1_CH18: R143.2 ; off-sheet PTB22/eMIOS_1_CH18  [project net PTB22]
PTB23/WKPU40: C90.1 R139.2 SW2.3 SW2.4 ; off-sheet PTB23/WKPU40
PTC14/eMIOS_1_CH4: R144.2 ; off-sheet PTC14/eMIOS_1_CH4  [project net PTC14]
PTC16/eMIOS_1_CH9: R141.2 ; off-sheet PTC16/eMIOS_1_CH9  [project net PTC16]
PTD5/EIRQ13: C88.1 R140.2 SW3.3 SW3.4 ; off-sheet PTD5/EIRQ13
NetD1_1: D1.1(ANODE) R142.2
NetD1_2: D1.2(CATHODE1) R141.1
NetD1_3: D1.3(CATHODE2) R143.1
NetD1_4: D1.4(CATHODE3) R144.1
NetD13_1: D13.1(A) R138.2

### Notes on the sheet
- SWITCH
- RGB LED
- (in symbol LRTBR48G_4P) R; G; B
- (in symbol TitleBlock_FS) Classification:; Drawing Title:; Page Title:; Size; Document Number; Rev; Date:; Sheet; of

### Library data of the parts
*#9 = TitleBlock_FS: Classification: Company Internal/Proprietary; OrgName: NXP Semiconductors; OrgAddr1: 6501 William Cannon Drive West; OrgAddr2: Austin, TX 78735-8598; Variant Name: <Core Design>; Page Create Date: March  8, 1995
C88 C90 = CAP_NP: CAP CER 0.1UF 16V 10% X7R 0402; CLASS: DISCRETE; Temp Range: -55C to +125C; SIGNAL_MODEL: DEFAULT_CAPACITOR_100000pF_2_1; AGILE_PN: 150-75182; MFG_NAME01: Samsung Electro-Mechanics; MFG_PN01: CL05B104KO5NNNC; CAD_APPROVED: Yes; FPLIST: CC0402_25,CC0402_HD,0402_CC,CAPC0402_L,cc0402_lamp3; Temp_Range: -55癈 to +85癈; 3D_Mechanical_Footprint_File: http://fcl.am.freescale.net/ALLEGRO/step/cc0402_25.STEP; Rated Voltage: 16V; Tolerance: 10%; ROHS: NULL; HEIGHT: 0.635mm; TOL: 10%; VOLTAGE: 16V
C89 = CAP_NP: CAP CER 0.1UF 16V 10% X7R 0402; CLASS: DISCRETE; Temp_Range: -55癈 to +85癈; FPLIST: CC0402_25,CC0402_HD,0402_CC,CAPC0402_L,cc0402_lamp3; CAD_APPROVED: Yes; MFG_PN01: CL05B104KO5NNNC; MFG_NAME01: Samsung Electro-Mechanics; AGILE_PN: 150-75182; SIGNAL_MODEL: DEFAULT_CAPACITOR_100000pF_2_1; Temp Range: -55C to +125C; VOLTAGE: 16V; TOL: 10%; HEIGHT: 0.635mm; ROHS: NULL; Tolerance: 10%; Rated Voltage: 16V; 3D_Mechanical_Footprint_File: http://fcl.am.freescale.net/ALLEGRO/step/cc0402_25.STEP
D1 = LRTBR48G_4P: LED RED/GRN/BL TRI 20/20/20MA SMT; CLASS: IC; AGILE_PN: 370-76899; CAD_APPROVED: YES; Temp Range: -40 to +100; MFG_NAME01: Lianyungang Meihua Electronics Technology Co.,Ltd; HEIGHT: 2.14mm; SILK: RGB; 3D_Mechanical_Footprint_File: http://fcl.am.freescale.net/ALLEGRO/step/led4_2p7x2p6_sm.step
D13 = LED-SMT
R137 = RES: RES MF 10K 1/16W 5% 0402; CLASS: DISCRETE; Temp_Range: ?5 癈 to +155 癈; FPLIST: RC0402_25,RC0402_HD,0402_CC; CAD_APPROVED: Yes; MFG_PN01: CR0402-JW-103GLF; MFG_NAME01: BOURNS; AGILE_PN: 470-75557; SIGNAL_MODEL: DEFAULT_RESISTOR_10000OHM_2_1; HEIGHT: 0.4MM; TOL: 5%; ROHS: NULL; Tolerance: 5%
R138 R143 R144 = RES: RES MF 470 OHM 1/16W 5% 0402; CLASS: DISCRETE; TOL: 1%; AGILE_PN: 470-30315; MFG_NAME01: PANASONIC; MFG_PN01: ERJ2GEJ471X; CAD_APPROVED: Yes; FPLIST: RC0402_25,RC0402_HD,0402_CC; SIGNAL_MODEL: DEFAULT_RESISTOR_430.000000OHM_2_1; Temp_Range: -55&#8451; to 155&#8451;; HEIGHT: 0.45; Tolerance: 5%; ROHS: Yes
R139 R140 = RES: as R99 on sheet 10 CAN; Tolerance: 5%; ROHS: NULL; TOL: 5%; HEIGHT: 0.4MM
R141 = RES: RES MF 470 OHM 1/16W 5% 0402; CLASS: DISCRETE; Temp_Range: -55&#8451; to 155&#8451;; SIGNAL_MODEL: DEFAULT_RESISTOR_430.000000OHM_2_1; FPLIST: RC0402_25,RC0402_HD,0402_CC; CAD_APPROVED: Yes; MFG_PN01: ERJ2GEJ471X; MFG_NAME01: PANASONIC; AGILE_PN: 470-30315; TOL: 1%; ROHS: Yes; Tolerance: 5%; HEIGHT: 0.45
R142 = RES: RES MF ZERO OHM 1/10W -- 0603; CLASS: DISCRETE; MFG_PN01: CRCW06030000Z0EAC; MFG_NAME01: VISHAY; Temp Range: –55 °C to +155 °C; CAD_APPROVED: Yes; FPLIST: RC0603_OV,RC0603,R603-X2,r603-x2_b,0603_CC,IND_0603HP_NSP,CC0603_OV_NSP; AGILE_PN: 470-80866; ROHS: NULL; HEIGHT: 0.6
SW1 SW3 = SW_PSHBT_SPST_2: SW SP PB 50mA 16V SMT; CLASS: IC; AGILE_PN: 510-78653; CAD_APPROVED: Yes; Temp Range: -40C to +85C; MFG_NAME01: WURTH ELEKTRONIK EISOS GMBH & CO. KG (ELECTRONIC & ELECTROMEHANICAL COMP); HEIGHT: 2.60; ROHS: Yes; 3D_Mechanical_Footprint_File: http://fcl.am.freescale.net/ALLEGRO/step/sw4_4p15_4p2x3p2_sm.STEP
SW2 = SW_PSHBT_SPST_2: SW SP PB 50mA 16V SMT; CLASS: IC; MFG_NAME01: WURTH ELEKTRONIK EISOS GMBH & CO. KG (ELECTRONIC & ELECTROMEHANICAL COMP); Temp Range: -40C to +85C; CAD_APPROVED: Yes; AGILE_PN: 510-78653; 3D_Mechanical_Footprint_File: http://fcl.am.freescale.net/ALLEGRO/step/sw4_4p15_4p2x3p2_sm.STEP; ROHS: Yes; HEIGHT: 2.60

## Sheet 13 HEADERS.SchDoc
size 513 x 386 mm
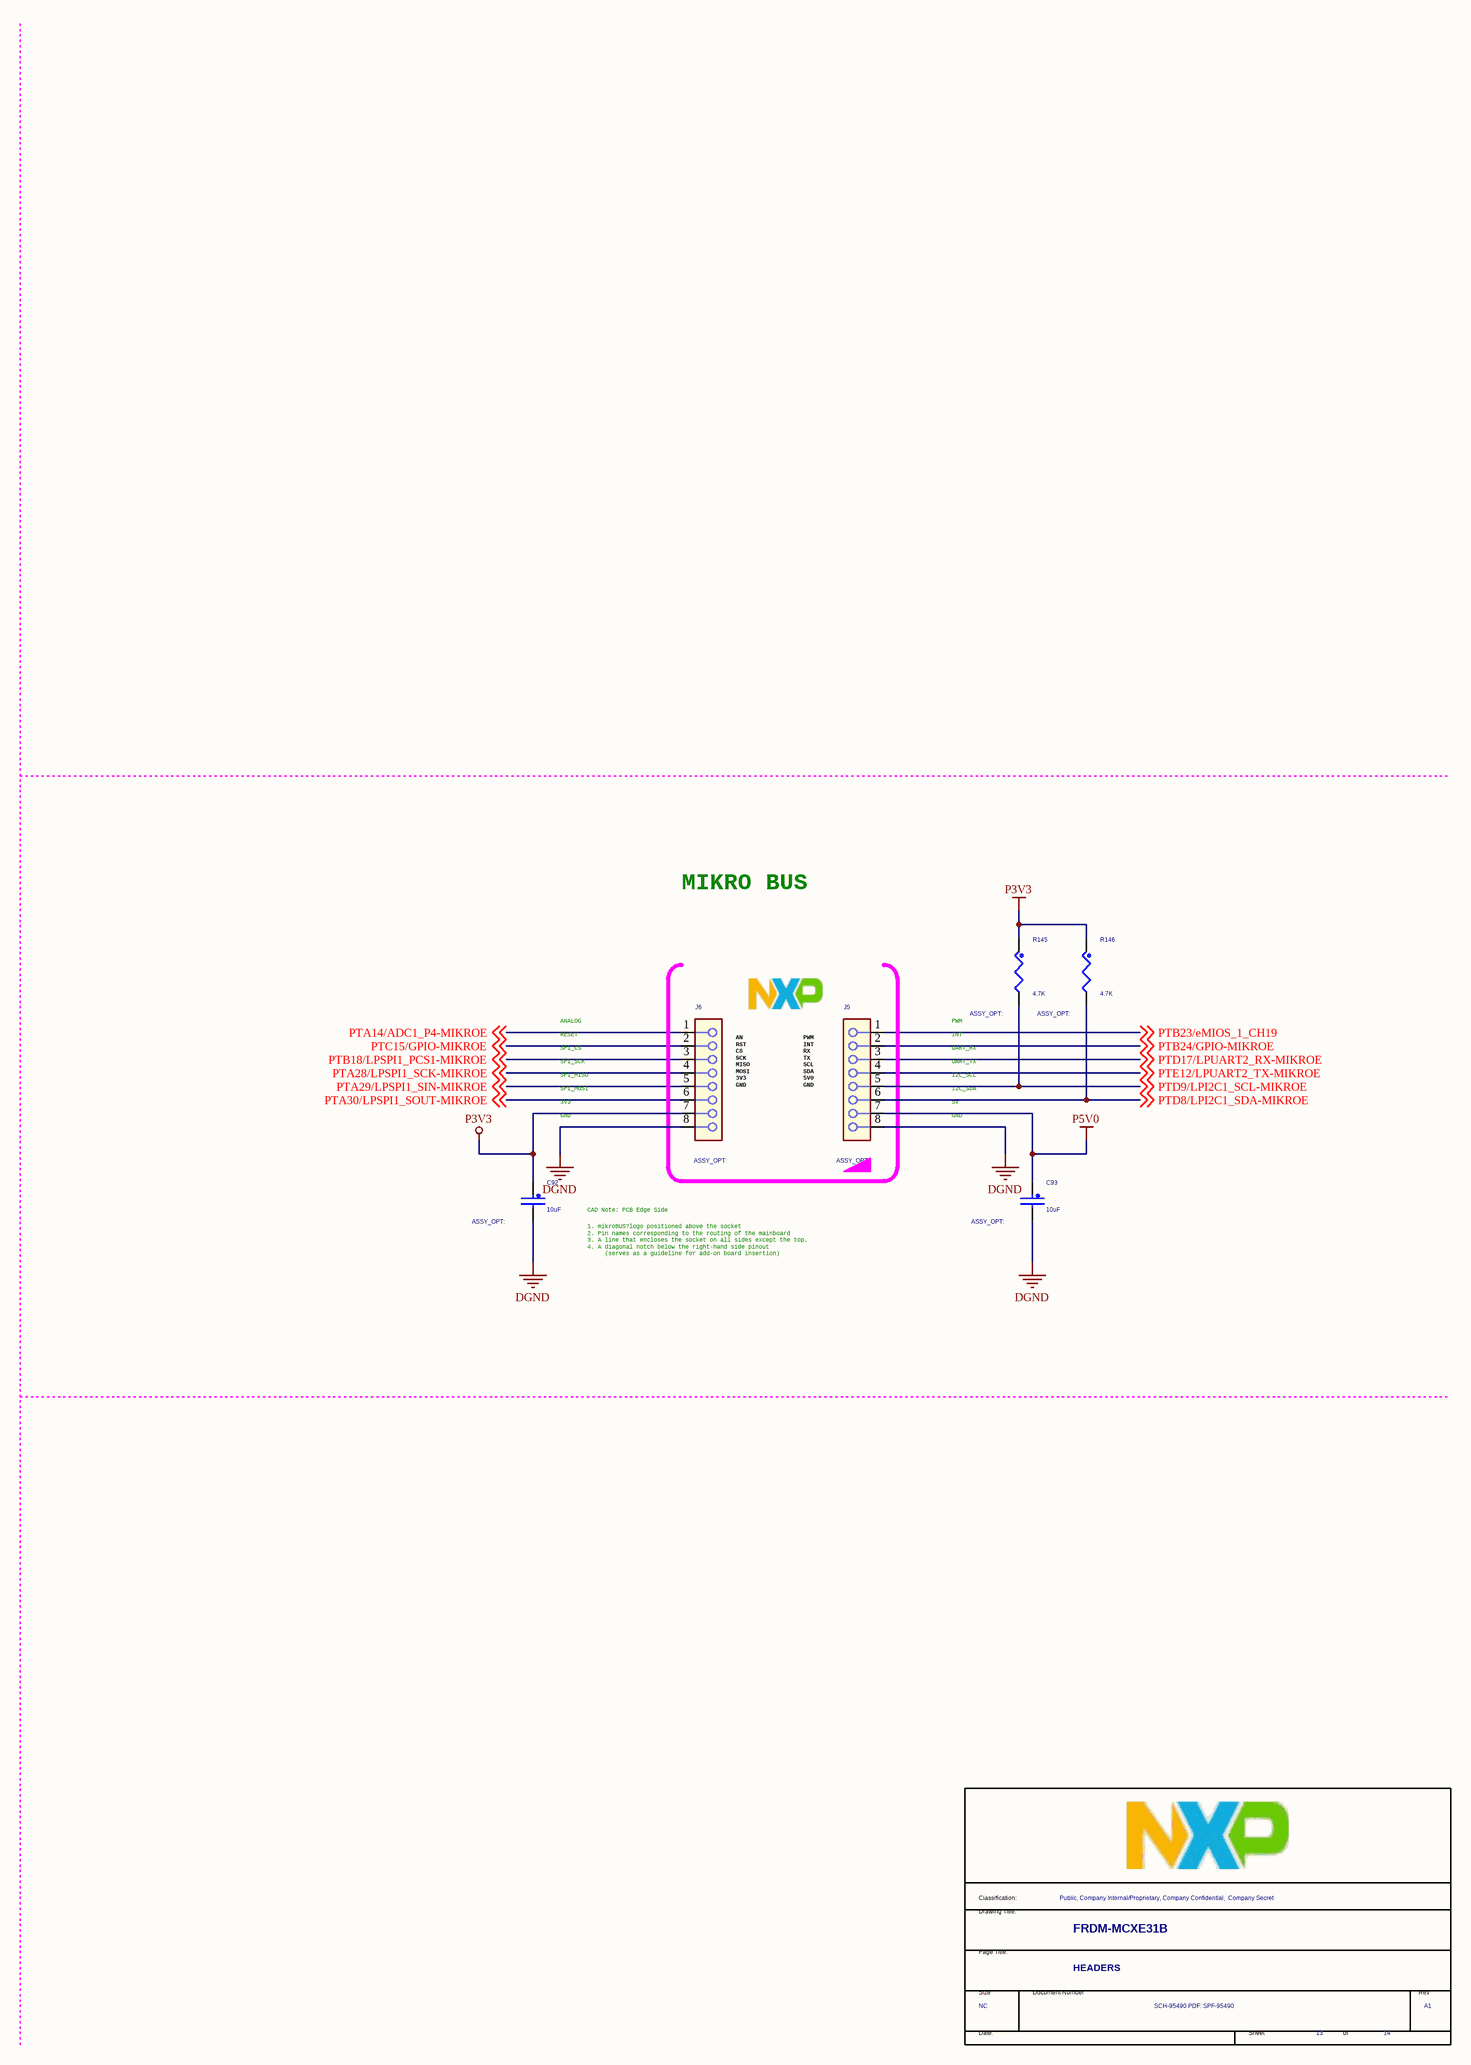
[diagram p16: 13 HEADERS.SchDoc]

### Parts
(Parts that share a designator on the sheet are numbered #1, #2 ... from top to bottom, then left to right.)
*#10  Title: FRDM-MCXE31B  RevCode: A1  PageTitle: HEADERS  Page Size: NC  Page Number: 13  Page Count: 14  Doc: SCH-95490 PDF: SPF-95490  Classification: Public, Company Internal/Proprietary, Company Confidential,  Company Secret  (hidden comment: TitleBlock_FS)  (graphical)
C92  10uF  [CC0603_OV]
C93  10uF  [CC0603_OV]
J5  SKT_1X8  [con_1x8_skt_2p54_th_126l]  (value not drawn)
J6  SKT_1X8  [con_1x8_skt_2p54_th_126l]  (value not drawn)
R145  4.7K  [RC0402_25]
R146  4.7K  [RC0402_25]

### Nets
DGND: C92.2 C93.2 J5.8 J6.8
P3V3: C92.1 J6.7 R145.1 R146.1
P5V0: C93.1 J5.7
PTA14/ADC1_P4-MIKROE: J6.1 ; off-sheet PTA14/ADC1_P4-MIKROE  [project net PTA14]
PTA28/LPSPI1_SCK-MIKROE: J6.4 ; off-sheet PTA28/LPSPI1_SCK-MIKROE  [project net PTA28]
PTA29/LPSPI1_SIN-MIKROE: J6.5 ; off-sheet PTA29/LPSPI1_SIN-MIKROE  [project net PTA29]
PTA30/LPSPI1_SOUT-MIKROE: J6.6 ; off-sheet PTA30/LPSPI1_SOUT-MIKROE  [project net PTA30]
PTB18/LPSPI1_PCS1-MIKROE: J6.3 ; off-sheet PTB18/LPSPI1_PCS1-MIKROE  [project net PTB18]
PTB23/eMIOS_1_CH19: J5.1 ; off-sheet PTB23/eMIOS_1_CH19  [project net PTB23]
PTB24/GPIO-MIKROE: J5.2 ; off-sheet PTB24/GPIO-MIKROE  [project net PTB24]
PTC15/GPIO-MIKROE: J6.2 ; off-sheet PTC15/GPIO-MIKROE  [project net PTC15]
PTD8/LPI2C1_SDA-MIKROE: J5.6 R146.2 ; off-sheet PTD8/LPI2C1_SDA-MIKROE  [project net PTD8]
PTD9/LPI2C1_SCL-MIKROE: J5.5 R145.2 ; off-sheet PTD9/LPI2C1_SCL-MIKROE  [project net PTD9]
PTD17/LPUART2_RX-MIKROE: J5.3 ; off-sheet PTD17/LPUART2_RX-MIKROE  [project net PTD17]
PTE12/LPUART2_TX-MIKROE: J5.4 ; off-sheet PTE12/LPUART2_TX-MIKROE  [project net PTE12]

### Notes on the sheet
- MIKRO BUS
- socket board
- ANALOG
- RESET
- SPI_CS
- SPI_SCK
- PWM
- INT
- UART_RX
- UART_TX
- SPI_MISO
- SPI_MOSI
- 3V3
- GND
- (near J6) AN
  RST
  CS
  SCK
  MISO
  MOSI
  3V3
  GND
- (near J5) PWM
  INT
  RX
  TX
  SCL
  SDA
  5V0
  GND
- I2C_SCL
- I2C_SDA
- 5V
- CAD Note: PCB Edge Side
- (near C93) 1. mikroBUS?logo positioned above the socket
  2. Pin names corresponding to the routing of the mainboard
  3. A line that encloses the socket on all sides except the top.
  4. A diagonal notch below the right-hand side pinout
  (serves as a guideline for add-on board insertion)
- (in symbol TitleBlock_FS) Classification:; Drawing Title:; Page Title:; Size; Document Number; Rev; Date:; Sheet; of

### Library data of the parts
*#10 = TitleBlock_FS: as *#9 on sheet 12 SWITCH & LED; Page Create Date: March  8, 1995
C92 = CAP_NP: CAP CER 10uF 25V 20% X5R 0603; CLASS: DISCRETE; FPLIST: CC0603_OV,CC0603,0603_cc_tol; MFG_PN01: GRM188R61E106MA73D; MFG_NAME01: MURATA; Temp Range: -55C to +85C; CAD_APPROVED: Yes; AGILE_PN: 150-79272; ROHS: Yes; Rated Voltage: 25V; Tolerance: 20%; HEIGHT: 1; Package Size: 0603
C93 = CAP_NP: CAP CER 10uF 25V 20% X5R 0603; CLASS: DISCRETE; AGILE_PN: 150-79272; CAD_APPROVED: Yes; Temp Range: -55C to +85C; MFG_NAME01: MURATA; MFG_PN01: GRM188R61E106MA73D; FPLIST: CC0603_OV,CC0603,0603_cc_tol; Package Size: 0603; HEIGHT: 1; Tolerance: 20%; Rated Voltage: 25V; ROHS: Yes
J5 J6 = CONN_HDR_8X1: CON 1X8 SKT TH 100MIL SP 344H AU 118L; CLASS: IO; MFG_PN01: 08001S3 0811-29RF; MFG_NAME01: ANYTRONIC CORPORATION LIMITED; Temp Range: -40°C to +105°C; CAD_APPROVED: Yes; FPLIST: con_1x8_skt_2p54_th_126l,con_1x8_skt_2p54_th; AGILE_PN: 210-81617; 3D_Mechanical_Footprint_File: http://fcl.am.freescale.net/ALLEGRO/step/con_1x8_skt_2p54_th_126l.STEP; ROHS: NULL; HEIGHT: 8.75mm
R145 R146 = RES: RES MF 4.7K 1/16W 5% 0402; CLASS: DISCRETE; Pkg: 0402; AGILE_PN: 470-75626; FPLIST: RC0402_25,RC0402_HD,0402_CC,RC0402_X2; CAD_APPROVED: Yes; MFG_NAME01: BOURNS; MFG_PN01: CR0402-JW-472GLF; HEIGHT: 0.41; Tolerance: 5%; ROHS: NULL

## Sheet CAN1.SchDoc
size A2
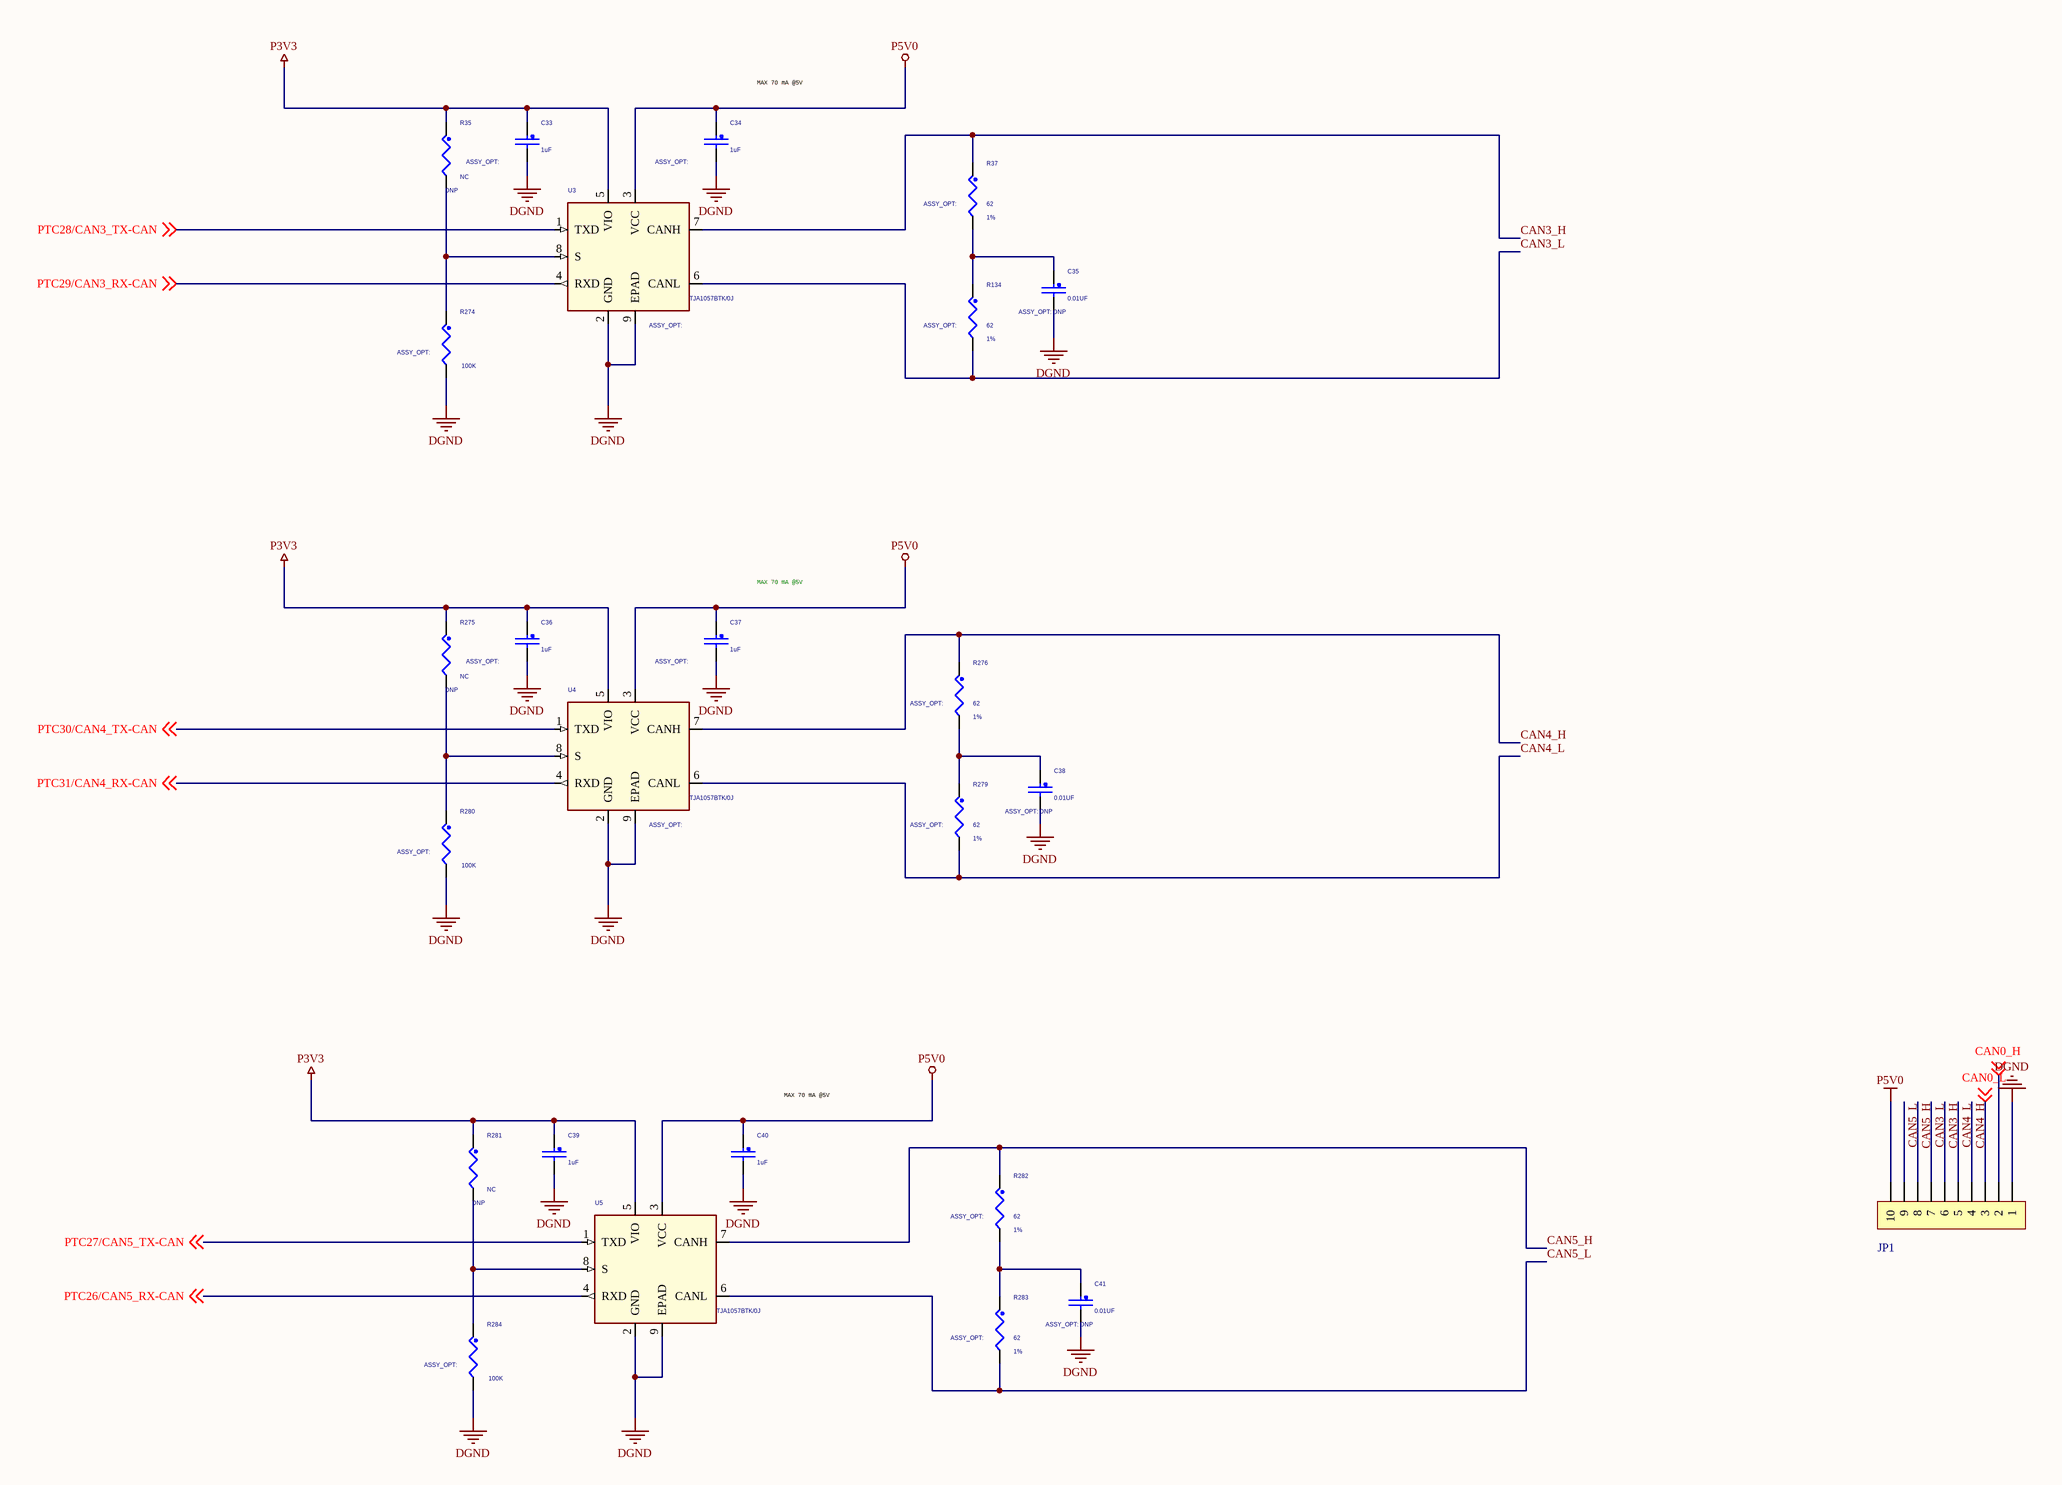
[diagram p17: CAN1.SchDoc]

### Parts
C33  1uF  [CC0402_25]
C34  1uF  [CC0402_25]
C35  0.01UF  ASSY_OPT: DNP  [CC0402_25]
C36  1uF  [CC0402_25]
C37  1uF  [CC0402_25]
C38  0.01UF  ASSY_OPT: DNP  [CC0402_25]
C39  1uF  [CC0402_25]
C40  1uF  [CC0402_25]
C41  0.01UF  ASSY_OPT: DNP  [CC0402_25]
JP1  HDR-1X10  [KF128-3.81-10P]  (value not drawn)
R35  NC  ASSY_OPT: DNP  [RC0402_25]
R37  62  Tolerance: 1%  [RC0805_OV]
R134  62  Tolerance: 1%  [RC0805_OV]
R274  100K  [RC0402_25]
R275  NC  ASSY_OPT: DNP  [RC0402_25]
R276  62  Tolerance: 1%  [RC0805_OV]
R279  62  Tolerance: 1%  [RC0805_OV]
R280  100K  [RC0402_25]
R281  NC  ASSY_OPT: DNP  [RC0402_25]
R282  62  Tolerance: 1%  [RC0805_OV]
R283  62  Tolerance: 1%  [RC0805_OV]
R284  100K  [RC0402_25]
U3  MFG_PN01: TJA1057BTK/0J  [son8_0p65_3p15x3p15]  (hidden comment: TJA1057BTK)
U4  MFG_PN01: TJA1057BTK/0J  [son8_0p65_3p15x3p15]  (hidden comment: TJA1057BTK)
U5  MFG_PN01: TJA1057BTK/0J  [son8_0p65_3p15x3p15]  (hidden comment: TJA1057BTK)

### Nets
DGND: C33.2 C34.2 C35.2 C36.2 C37.2 C38.2 C39.2 C40.2 C41.2 JP1.1 R274.2 R280.2 R284.2 U3.2(GND) U3.9(EPAD) U4.2(GND) U4.9(EPAD) U5.2(GND) U5.9(EPAD)
P3V3: C33.1 C36.1 C39.1 R35.1 R275.1 R281.1 U3.5(VIO) U4.5(VIO) U5.5(VIO)
P5V0: C34.1 C37.1 C40.1 JP1.10 U3.3(VCC) U4.3(VCC) U5.3(VCC)
CAN0_H: JP1.2 ; off-sheet CAN0_H
CAN0_L: JP1.3 ; off-sheet CAN0_L
CAN3_H: JP1.6 R37.1 U3.7(CANH)
CAN3_L: JP1.7 R134.2 U3.6(CANL)
CAN4_H: JP1.4 R276.1 U4.7(CANH)
CAN4_L: JP1.5 R279.2 U4.6(CANL)
CAN5_H: JP1.8 R282.1 U5.7(CANH)
CAN5_L: JP1.9 R283.2 U5.6(CANL)
PTC26/CAN5_RX-CAN: U5.4(RXD) ; off-sheet PTC26/CAN5_RX-CAN  [project net PTC26]
PTC27/CAN5_TX-CAN: U5.1(TXD) ; off-sheet PTC27/CAN5_TX-CAN  [project net PTC27]
PTC28/CAN3_TX-CAN: U3.1(TXD) ; off-sheet PTC28/CAN3_TX-CAN  [project net PTC28]
PTC29/CAN3_RX-CAN: U3.4(RXD) ; off-sheet PTC29/CAN3_RX-CAN  [project net PTC29]
PTC30/CAN4_TX-CAN: U4.1(TXD) ; off-sheet PTC30/CAN4_TX-CAN  [project net PTC30]
PTC31/CAN4_RX-CAN: U4.4(RXD) ; off-sheet PTC31/CAN4_RX-CAN  [project net PTC31]
NetC35_1: C35.1 R37.2 R134.1
NetC38_1: C38.1 R276.2 R279.1
NetC41_1: C41.1 R282.2 R283.1
NetR35_2: R35.2 R274.1 U3.8(S)
NetR275_2: R275.2 R280.1 U4.8(S)
NetR281_2: R281.2 R284.1 U5.8(S)

### Notes on the sheet
- MAX 70 mA @5V

### Library data of the parts
C33 C34 C39 = CAP_NP: as C69 on sheet 10 CAN; Rated Voltage: 16V; VOLTAGE: 16V; HEIGHT: 0.55; ROHS: Yes; Tolerance: 10%
C35 = CAP_NP: as C71 on sheet 10 CAN; HEIGHT: 0.55MM; Tolerance: 10%; Rated Voltage: 50V; ROHS: NULL
C36 C37 C40 = CAP_NP: as C72 on sheet 10 CAN; Tolerance: 10%; ROHS: Yes; HEIGHT: 0.55; VOLTAGE: 16V; Rated Voltage: 16V
C38 C41 = CAP_NP: as C74 on sheet 10 CAN; ROHS: NULL; Rated Voltage: 50V; Tolerance: 10%; HEIGHT: 0.55MM
JP1 = Header 10: 10P接插件; BOM名称: 10P接插件
R35 R281 = RES: as R93 on sheet 10 CAN; HEIGHT: 0.4MM; TOL: 5%; ROHS: NULL; Tolerance: 5%
R37 R276 R279 = RES: as R94 on sheet 10 CAN; 3D_Mechanical_Footprint_File: http://fcl.am.freescale.net/ALLEGRO/step/RC0805_OV.STEP; ROHS: Yes; HEIGHT: 0.60; Package Size: 0805 (2012 Metric)
R134 R282 R283 = RES: as R97 on sheet 10 CAN; Package Size: 0805 (2012 Metric); HEIGHT: 0.60; ROHS: Yes; 3D_Mechanical_Footprint_File: http://fcl.am.freescale.net/ALLEGRO/step/RC0805_OV.STEP
R274 R284 = RES: as R98 on sheet 10 CAN; ROHS: Yes; Tolerance: 1%; HEIGHT: 0.4
R275 = RES: as R99 on sheet 10 CAN; Tolerance: 5%; ROHS: NULL; TOL: 5%; HEIGHT: 0.4MM
R280 = RES: as R104 on sheet 10 CAN; HEIGHT: 0.4; Tolerance: 1%; ROHS: Yes
U3 U4 = TJA1051TK_3_HVSON8: as U11 on sheet 10 CAN; CLASS: IC; 3D_Mechanical_Footprint_File: http://fcl.am.freescale.net/ALLEGRO/step/son8_0p65_3p15x3p15.STEP; ROHS: NULL; HEIGHT: 1mm; Package Size: HVSON-8
U5 = TJA1051TK_3_HVSON8: as U13 on sheet 10 CAN; CLASS: IC; Package Size: HVSON-8; HEIGHT: 1mm; ROHS: NULL; 3D_Mechanical_Footprint_File: http://fcl.am.freescale.net/ALLEGRO/step/son8_0p65_3p15x3p15.STEP

## Sheet UART.SchDoc
size A2
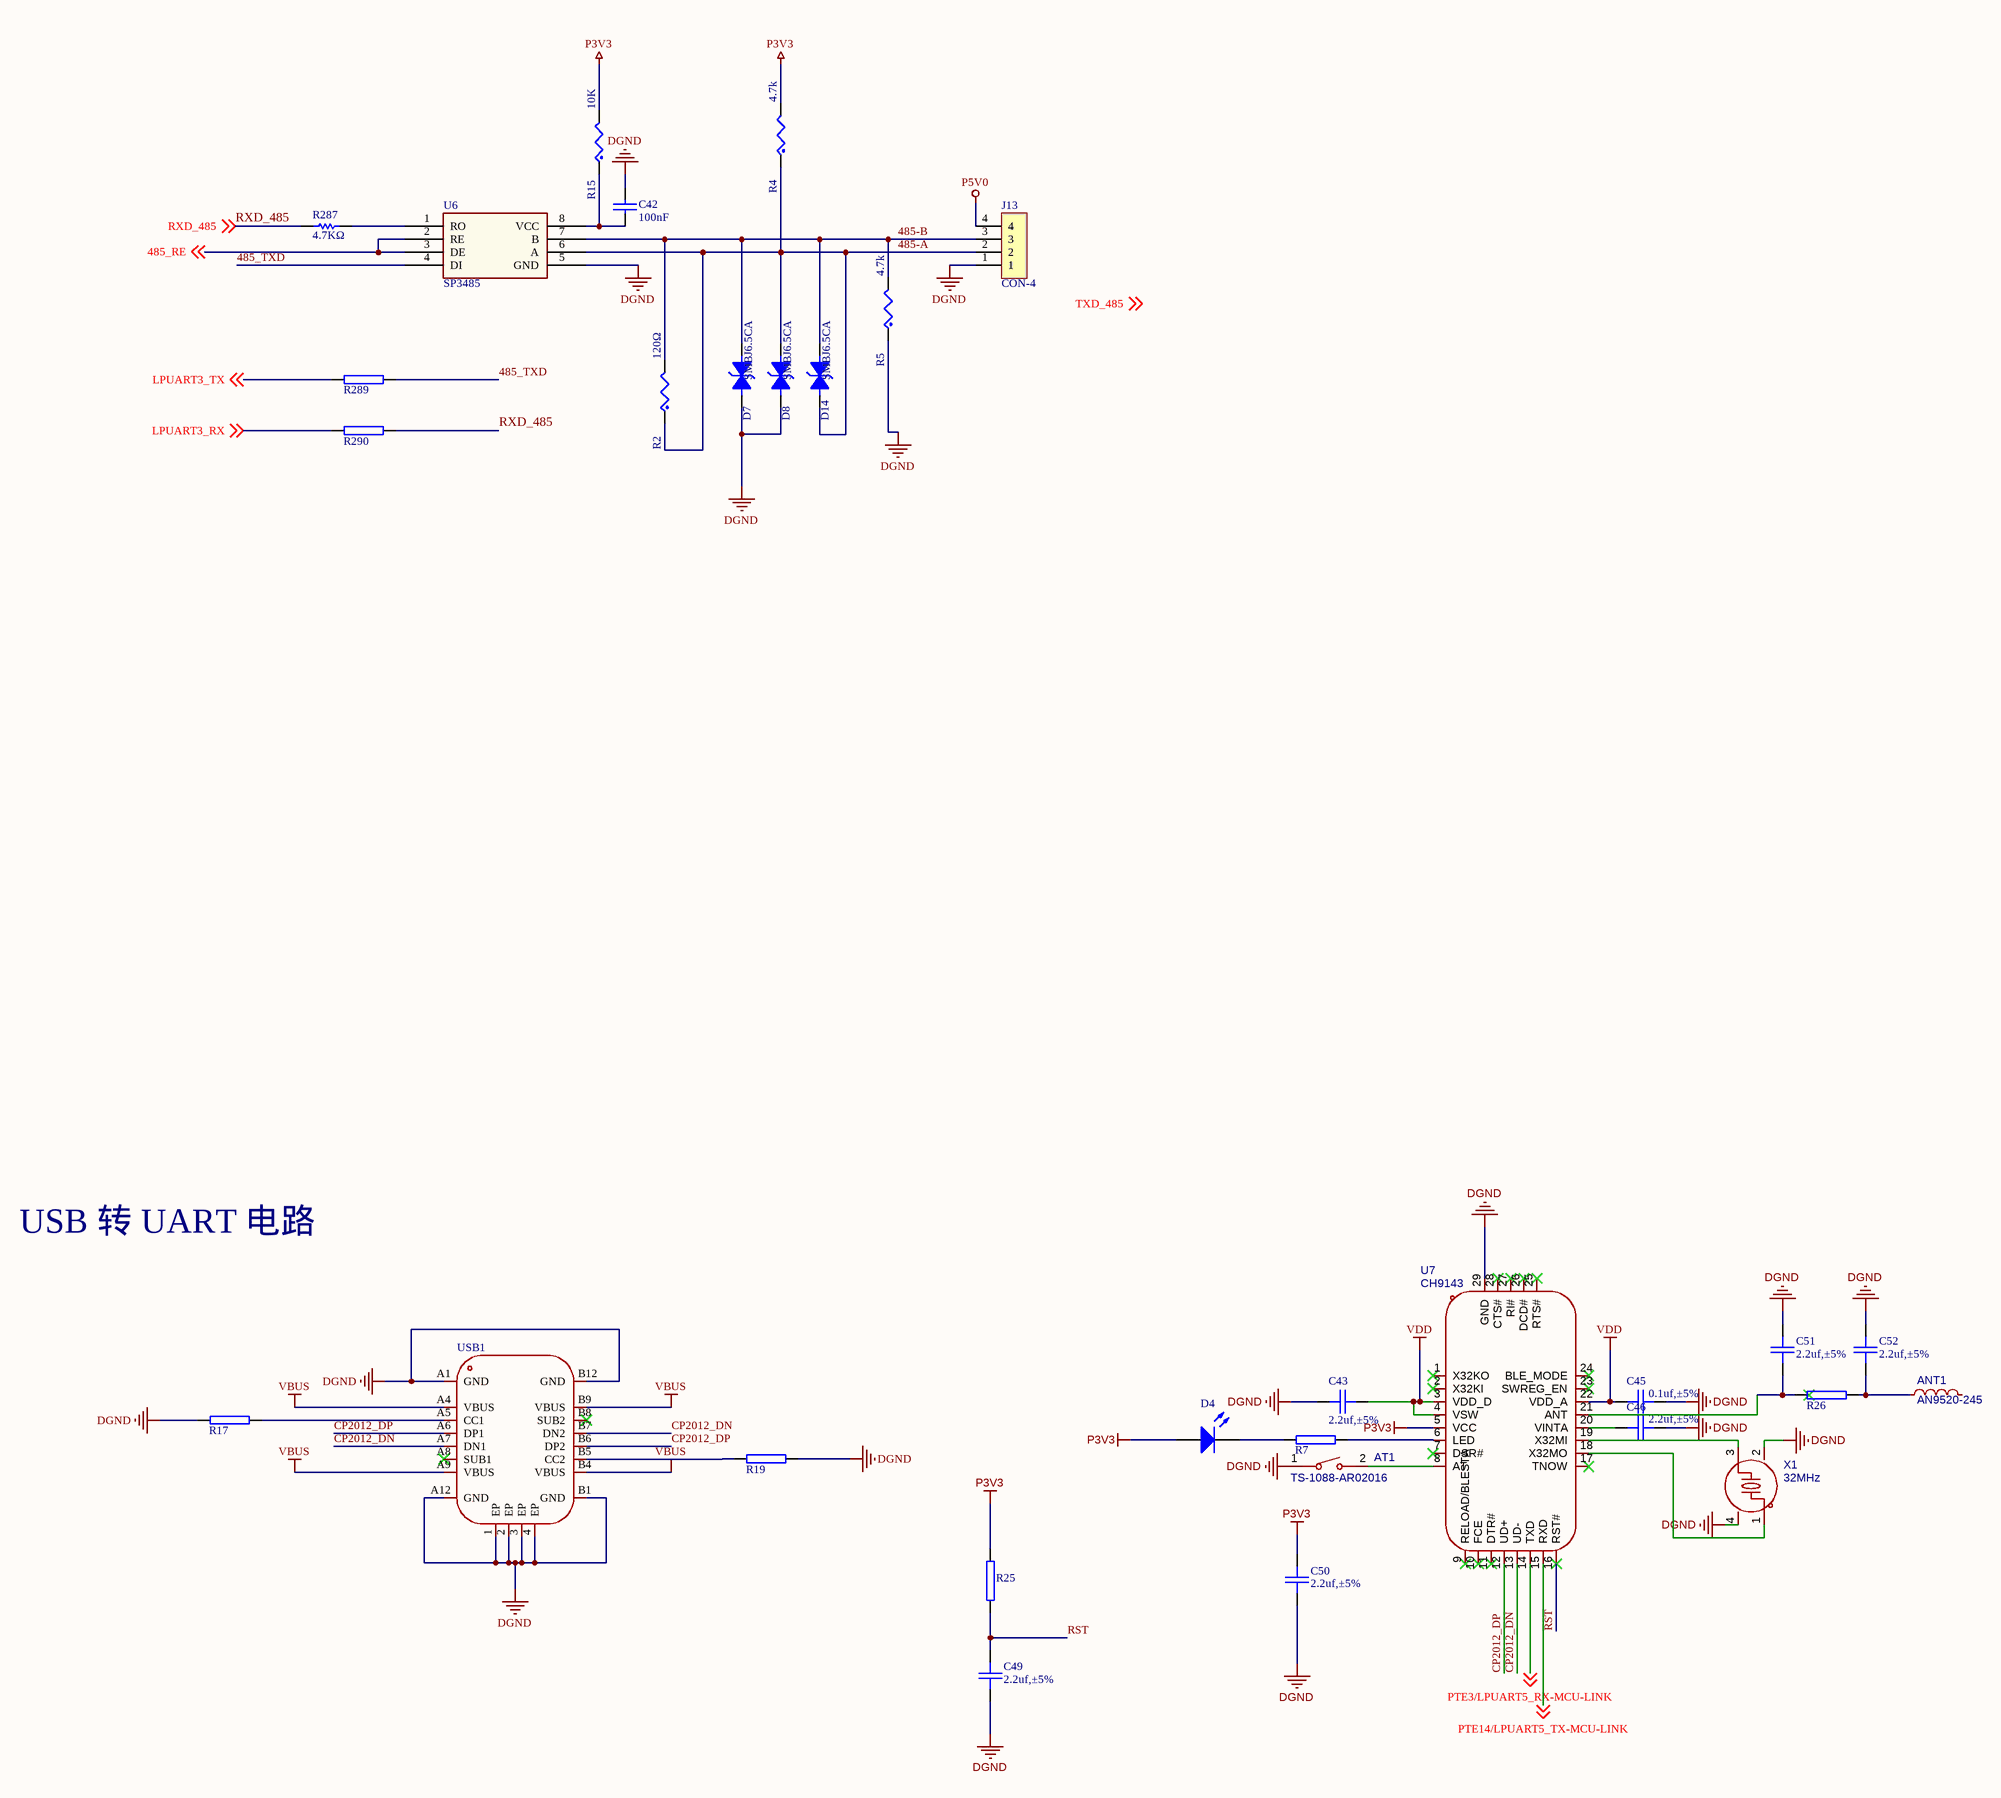
[diagram p18: UART.SchDoc]

### Parts
ANT1  AN9520-245  [ANT-SMD_L9.5-W2.1]
AT1  TS-1088-AR02016  [SW-SMD_L3.9-W3.0-P4.45]
C42  100nF  [CC0402_25]
C43  2.2uf,±5%  [CC0402_25]
C45  0.1uf,±5%  [CC0402_25]
C46  2.2uf,±5%  [CC0402_25]
C49  2.2uf,±5%  [CC0402_25]
C50  2.2uf,±5%  [CC0402_25]
C51  2.2uf,±5%  [CC0402_25]
C52  2.2uf,±5%  [CC0402_25]
D4  (no value)  [LED 0603R]
D7  SMBJ6.5CA  [1812]
D8  SMBJ6.5CA  [1812]
D14  SMBJ6.5CA  [1812]
J13  CON-4  [GSP003RC-4-3.5]
R2  120Ω  [RC0603_OV]
R4  4.7k  [RC0603_OV]
R5  4.7k  [RC0603_OV]
R7  5k1  [RC0402_25]  (value not drawn)
R15  10K  [RC0603_OV]
R17  5k1  [RC0402_25]  (value not drawn)
R19  5k1  [RC0402_25]  (value not drawn)
R25  5k1  [RC0402_25]  (value not drawn)
R26  0  [0805R]  (value not drawn)
R287  4.7KΩ  [R0402]
R289  0  [RC0402_25]  (value not drawn)
R290  0  [RC0402_25]  (value not drawn)
U6  SP3485  [SOP-8]
U7  CH9143  [QFN-28_L4.0-W4.0-P0.40-BL-EP2.7]
USB1  KH-TYPE-C-16P  [USB-C-SMD_KH-TYPE-C-16P]  (value not drawn)
X1  32MHz  [CRYSTAL-SMD_4P-L2.0-W1.6-BL]

### Nets
DGND: AT1.1 C42.2 C43.1 C45.2 C46.2 C49.1 C50.1 C51.2 C52.2 D7.1(CATHODE) D8.1(CATHODE) J13.1 R5.1 R17.2 R19.1 U6.5(GND) U7.29(GND) USB1.1(EP) USB1.2(EP) USB1.3(EP) USB1.4(EP) USB1.A1(GND) USB1.A12(GND) USB1.B1(GND) USB1.B12(GND) X1.2(GND) X1.4(GND)
P3V3: C50.2 D4.1(A) R4.2 R15.2 R25.1 U7.5(VCC)
P5V0: J13.4
VBUS: USB1.A4(VBUS) USB1.A9(VBUS) USB1.B4(VBUS) USB1.B9(VBUS)
VDD: C43.2 C45.1 U7.3(VDD_D) U7.4(VSW) U7.22(VDD_A)
485-A: D8.2(ANODE) D14.1(CATHODE) J13.2 R2.1 R4.1 U6.6(A)
485-B: D7.2(ANODE) D14.2(ANODE) J13.3 R2.2 R5.2 U6.7(B)
485_RE: U6.2(RE) U6.3(DE) ; off-sheet 485_RE
485_TXD: R289.1 U6.4(DI)
CP2012_DN: U7.13(UD-) USB1.A7(DN1) USB1.B7(DN2)
CP2012_DP: U7.12(UD+) USB1.A6(DP1) USB1.B6(DP2)
LPUART3_RX: R290.2 ; off-sheet LPUART3_RX
LPUART3_TX: R289.2 ; off-sheet LPUART3_TX
PTE3/LPUART5_RX-MCU-LINK: U7.14(TXD) ; off-sheet PTE3/LPUART5_RX-MCU-LINK  [project net PTE3]
PTE14/LPUART5_TX-MCU-LINK: U7.15(RXD) ; off-sheet PTE14/LPUART5_TX-MCU-LINK  [project net PTE14]
RST: C49.2 R25.2 U7.16(RST#)
RXD_485: R287.2 R290.1 ; off-sheet RXD_485
NetANT1_1: ANT1.1 C52.1 R26.1
NetAT1_2: AT1.2 U7.8(AT)
NetC42_1: C42.1 R15.1 U6.8(VCC)
NetC46_1: C46.1 U7.20(VINTA)
NetC51_1: C51.1 R26.2 U7.21(ANT)
NetD4_2: D4.2(K) R7.2
NetR7_1: R7.1 U7.6(LED)
NetR17_1: R17.1 USB1.A5(CC1)
NetR19_2: R19.2 USB1.B5(CC2)
NetR287_1: R287.1 U6.1(RO)
NetU7_18: U7.18(X32MO) X1.1
NetU7_19: U7.19(X32MI) X1.3

Not connected (* = marked no-connect by the designer): ANT1 2; U7 1(X32KO)* 2(X32KI)* 7(DSR#)* 9(RELOAD/BLESTA)* 10(FCE)* 11(DTR#)* 17(TNOW)* 23(SWREG_EN)* 24(BLE_MODE)* 25(RTS#)* 26(DCD#)* 27(RI#)* 28(CTS#)*; USB1 A8(SUB1)* B8(SUB2)*

### Notes on the sheet
- USB 转 UART 电路
- Labels drawn without touching a wire or pin: TXD_485

### Library data of the parts
ANT1 = AN9520-245: 2.4G陶瓷天线/适用于WIFI蓝牙; Manufacturer: rainsun(霖昱微); AddInBom: yes; ModelId: 396f7a811e674750a977a0c0cdc4ad7a; ModelName: ANT-SMD_L9.5-W2.1-H1.0; ModelTransform: 374.015,82.677,0,0,0,0,0.005,0,0; Symbol: AN9520-245; Device: AN9520-245; Supplier: LCSC; Manufacturer Part: AN9520-245; Supplier Part: C99665; JLCPCB Part Class: 扩展库; LCSC Part Name: AN9520-245; Supplier Footprint: SMD,2.1x9.5mm; Datasheet: https://atta.szlcsc.com/upload/public/pdf/source/20170425/1493115807294.pdf; ConvertToPcb: yes; FootprintName: ANT-SMD_L9.5-W2.1
AT1 = TS-1088-AR02016: 电路结构:单刀单掷;按钮形状:圆形按钮;作用力:160gf;安装方式:立贴;开关长度:4mm;开关宽度:3mm;开关高度:2mm;带支架:不带;触点电流:50mA;额定电压(DC):12V;绝缘电阻:100MΩ;机械寿命:10万次;; Manufacturer: XUNPU(讯普); AddInBom: yes; ModelId: b26698b69f274ffabef8a26c7d0e5dd1; ModelName: SW-SMD_L3.9-W2.9-H2.0-LS4.8; ModelTransform: 188.976,114.174,0,0,0,0,0,0,0; Circuit: 单刀单掷; Actuator Style: 圆形按钮; Operating Force: 160gf; Switch Length: 4mm; Switch Width: 3mm; Switch Height: 2mm; Strike Gundam: 不带; Contact Current: 50mA; Voltage Rating (DC): 12V; Insulation Resistance: 100MΩ; Actuator/Cap Color: 黑色; Pin Style: SMD接片; Mechanical Life: 10万次; Symbol: TS-1088-AR02016; Device: TS-1088-AR02016; Supplier: LCSC; Supplier Part: C720477; Manufacturer Part: TS-1088-AR02016; JLCPCB Part Class: 扩展库; LCSC Part Name: 4*3*2mm 立贴 轻触开关; Supplier Footprint: SMD; Datasheet: https://atta.szlcsc.com/upload/public/pdf/source/20200810/C720475_60D09DD6C54279ADDB2DC25100F1CC11.pdf; ConvertToPcb: yes; FootprintName: SW-SMD_L3.9-W3.0-P4.45; Mounting Style: 立贴; Operating Temperature: -30℃~+80℃
C42 = CAP: Capacitor
C43 C45 C46 C49-C52 = CAP1: Capacitor; 物料代码: 1.02.01.0032; 名称: 电容; 封装: 0603; 设备封装名称: C0603_104_X7R_50V_10%; 厂商: muRata; 型号: 104,±10%,50V,X7R; 贴片和直插: SMT; 器件优选方案: 量产物料,优先选用; RoHS: RoHS; ComponentLink1Description: ErpDataInfo; ComponentLink1URL: http://erp.zlgmcu.com/ErpExt/ErpData/ListMateriel.aspx?pkey=1.02.01.0032
  C43 C46 C49-C52: Value: 2.2uf,±5%
  C45: Value: 0.1uf,±5%
D4 = LED-SMT
D7 D8 D14 = BV05C
R2 R4 R5 R15 = RES: RES MF ZERO OHM 1/10W -- 0603; CLASS: DISCRETE; MFG_PN01: RC0603FR-070RL; MFG_NAME01: YAGEO AMERICA; Temp Range: –55 °C to +155 °C; CAD_APPROVED: Yes; FPLIST: RC0603_OV,RC0603,R603-X2,r603-x2_b,0603_CC,IND_0603HP_NSP,CC0603_OV_NSP; AGILE_PN: 470-80866; PCB Footprint: RC0603_OV; ROHS: Yes; HEIGHT: 0.6
R7 R17 R19 R25 R26 R289 R290 = RES2
R287 = Res1: Resistor; Value: 1K; Published: 8-Jun-2000; LatestRevisionDate: 17-Jul-2002; LatestRevisionNote: Re-released for DXP Platform.; PackageReference: AXIAL-0.3; Publisher: Altium Limited; PackageDescription: Axial Device, Thru-Hole; 2 Leads; 0.3 in Pin Spacing
U7 = CH9143: Manufacturer: WCH(南京沁恒); AddInBom: yes; ModelId: 11f4b67ac5604b8a9b305e4266e81461; ModelName: QFN-28_L4.0-W4.0-H0.9-P0.40-BL-EP; ModelTransform: 157.48,157.48,0,90,0,0,0,0,0; Symbol: CH9143; Device: CH9143; Supplier: LCSC; Supplier Part: C2887252; Manufacturer Part: CH9143; JLCPCB Part Class: 扩展库; LCSC Part Name: CH9143; Supplier Footprint: QFN-28-EP(4x4); Datasheet: https://atta.szlcsc.com/upload/public/pdf/source/20210823/518548123B20D2A3F85102F56E355BAB.pdf; ConvertToPcb: yes; FootprintName: QFN-28_L4.0-W4.0-P0.40-BL-EP2.7
USB1 = KH-TYPE-C-16P: 连接器类型:Type-C;标准:-;公母:母;端口数量:1;触点数量:16P;安装方式:卧贴;额定电流 - 电源:3A;工作温度范围:-40℃~+85℃;; Manufacturer: kinghelm(金航标); Add into BOM: yes; Connector Type: Type-C; Gender: 母; Number of Ports: 1; Number of Contacts: 16P; Current Rating - Power (Max): 3A; Symbol: KH-TYPE-C-16P; Device: KH-TYPE-C-16P; LCSC Part Name: Type-C 母 卧贴; Supplier Part: C709357; Manufacturer Part: KH-TYPE-C-16P; Supplier Footprint: SMD; Datasheet: https://atta.szlcsc.com/upload/public/pdf/source/20200911/C709357_AA8DCEB38BB20E3035A7ED7AE7667837.pdf; Supplier: LCSC; Convert to PCB: yes; Standard: -; Mounting Style: 卧贴; Operating Temperature Range: -40℃~+85℃
X1 = XL7EL89CKI-111YLC-32M: 晶振类型:贴片晶振;频率:32MHz;常温频差:±10ppm;外接负载电容:8pF;频率稳定度(全温):±20ppm;; Manufacturer: YXC(扬兴晶振); AddInBom: yes; ModelId: 51ae9b24ba7a408881f7752b57b66e45; ModelTransform: 80.709,64.961,0,0,0,0,0,0,0; Crystal Type: 贴片晶振; Normal temperature Frequency Tolerance: ±10ppm; External load capacitor: 8pF; Frequency Stability(Full temperature range): ±20ppm; Symbol: XL7EL89CKI-111YLC-32M; Device: XL7EL89CKI-111YLC-32M; Supplier: LCSC; Supplier Part: C2965582; Manufacturer Part: XL7EL89CKI-111YLC-32M; Value: 32MHz; JLCPCB Part Class: 扩展库; LCSC Part Name: 32MHz ±10ppm 8pF; Supplier Footprint: SMD2016-4P; Datasheet: https://atta.szlcsc.com/upload/public/pdf/source/20220805/1793424D7D9A48ECE748A7A37B9248AD.pdf; ConvertToPcb: yes; FootprintName: CRYSTAL-SMD_4P-L2.0-W1.6-BL; ModelName: CRYSTAL-SMD_4P-L2.0-W1.6-BL; Equivalent Series Resistance (ESR): -; Operating Temperature: -40℃~+85℃

## Sheet UART2.SchDoc
size A2
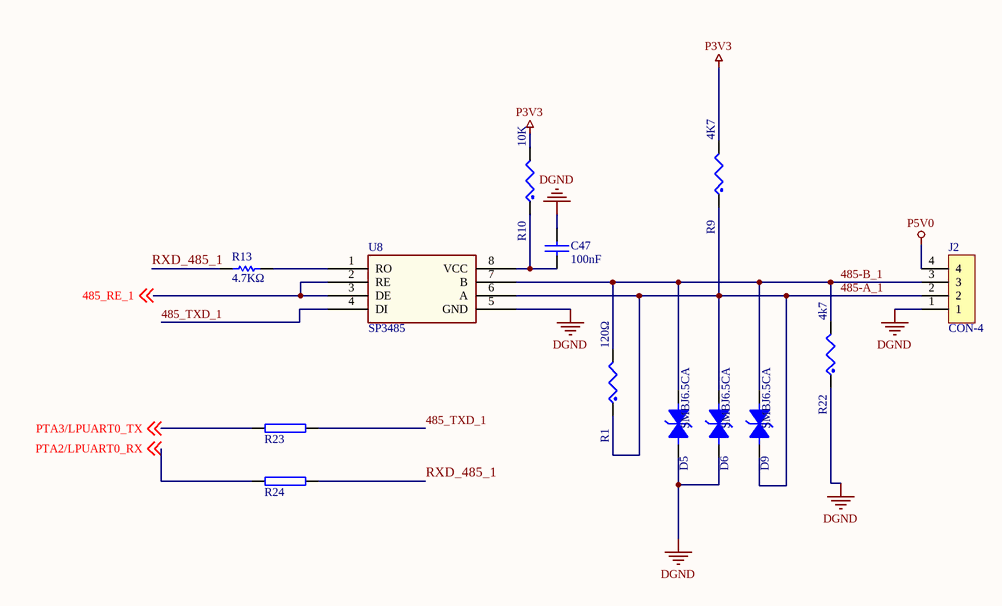
[diagram p19: UART2.SchDoc]

### Parts
C47  100nF  [CC0402_25]
D5  SMBJ6.5CA  [1812]
D6  SMBJ6.5CA  [1812]
D9  SMBJ6.5CA  [1812]
J2  CON-4  [GSP003RC-4-3.5]
R1  120Ω  [RC0603_OV]
R9  4K7  [RC0603_OV]
R10  10K  [RC0603_OV]
R13  4.7KΩ  [R0402]
R22  4k7  [RC0603_OV]
R23  0  [RC0402_25]  (value not drawn)
R24  0  [RC0402_25]  (value not drawn)
U8  SP3485  [SOP-8]

### Nets
DGND: C47.2 D5.1(CATHODE) D6.1(CATHODE) J2.1 R22.1 U8.5(GND)
P3V3: R9.2 R10.2
P5V0: J2.4
485-A_1: D6.2(ANODE) D9.1(CATHODE) J2.2 R1.1 R9.1 U8.6(A)
485-B_1: D5.2(ANODE) D9.2(ANODE) J2.3 R1.2 R22.2 U8.7(B)
485_RE_1: U8.2(RE) U8.3(DE) ; off-sheet 485_RE_1
485_TXD_1: R23.1 U8.4(DI)
PTA2/LPUART0_RX: R24.2 ; off-sheet PTA2/LPUART0_RX  [project net PTA2]
PTA3/LPUART0_TX: R23.2 ; off-sheet PTA3/LPUART0_TX  [project net PTA3]
RXD_485_1: R13.2 R24.1
NetC47_1: C47.1 R10.1 U8.8(VCC)
NetR13_1: R13.1 U8.1(RO)

### Library data of the parts
C47 = CAP: Capacitor
D5 D6 D9 = BV05C
R1 R9 R10 R22 = RES: as R2 on sheet UART; PCB Footprint: RC0603_OV; ROHS: Yes; HEIGHT: 0.6
R13 = Res1: Resistor; Value: 1K; Published: 8-Jun-2000; LatestRevisionDate: 17-Jul-2002; LatestRevisionNote: Re-released for DXP Platform.; PackageReference: AXIAL-0.3; Publisher: Altium Limited; PackageDescription: Axial Device, Thru-Hole; 2 Leads; 0.3 in Pin Spacing
R23 R24 = RES2

## Nets that join several sheets
DGND: 03 POWER (6 pins), 05 MCU_C (39 pins), 08 MCU_LINK_DEBUG (C55.2 J15.5), 09 ETHERNET_ENET (26 pins), 10 CAN (18 pins), 12 SWITCH & LED (9 pins), 13 HEADERS (C92.2 C93.2 J5.8 J6.8), CAN1 (19 pins), UART (27 pins), UART2 (6 pins)
P3V3: 03 POWER (C3.1 C4.1 R3.1 U2.5), 05 MCU_C (23 pins), 08 MCU_LINK_DEBUG (J15.1 R27.1), 09 ETHERNET_ENET (C44.1 L3.1 R66.2 Y3.4), 10 CAN (9 pins), 12 SWITCH & LED (5 pins), 13 HEADERS (C92.1 J6.7 R145.1 R146.1), CAN1 (9 pins), UART (6 pins), UART2 (R9.2 R10.2)
P5V0: 03 POWER (5 pins), 10 CAN (6 pins), 13 HEADERS (C93.1 J5.7), CAN1 (7 pins), UART (J13.4), UART2 (J2.4)
VBUS: 03 POWER (D2.A), UART (USB1.A4 USB1.A9 USB1.B4 USB1.B9)
CAN0_H: 10 CAN (R94.1 U11.7), CAN1 (JP1.2)
CAN0_L: 10 CAN (R97.2 U11.6), CAN1 (JP1.3)
ENET_CRS_DV/MODE2: 04 MCU_AB (U1.65), 09 ETHERNET_ENET (R74.1 R85.1)
ENET_MDC: 04 MCU_AB (U1.47), 09 ETHERNET_ENET (U10.17)
ENET_MDIO: 04 MCU_AB (U1.48), 09 ETHERNET_ENET (R67.2 U10.16)
ENET_PHY_RST: 04 MCU_AB (U1.49), 09 ETHERNET_ENET (C68.1 R81.2 U10.19)
ENET_RXD0/MODE0: 04 MCU_AB (U1.61), 09 ETHERNET_ENET (R76.1 R84.1)
ENET_RXD1/MODE1: 04 MCU_AB (U1.62), 09 ETHERNET_ENET (R78.1 R86.1)
ENET_TXCLK: 04 MCU_AB (U1.55), 09 ETHERNET_ENET (R80.2)
ENET_TXD0: 04 MCU_AB (U1.50), 09 ETHERNET_ENET (U10.22)
ENET_TXD1: 04 MCU_AB (U1.51), 09 ETHERNET_ENET (U10.23)
ENET_TXEN: 04 MCU_AB (U1.54), 09 ETHERNET_ENET (R72.1)
LPUART3_RX: 04 MCU_AB (U1.120), UART (R290.2)
LPUART3_TX: 04 MCU_AB (U1.121), UART (R289.2)
PTA2: 04 MCU_AB (U1.124), UART2 (R24.2)
PTA3: 04 MCU_AB (U1.123), UART2 (R23.2)
PTA4: 04 MCU_AB (U1.170), 08 MCU_LINK_DEBUG (J15.2)
PTA5: 04 MCU_AB (U1.167), 06 MCU_PORT (R42.1), 12 SWITCH & LED (5 pins)
PTA5/RESET_B-MCU-LINK: 06 MCU_PORT (R42.2), 08 MCU_LINK_DEBUG (C55.1 J15.4 R27.2)
PTA6: 04 MCU_AB (U1.102), 10 CAN (U11.4)
PTA7: 04 MCU_AB (U1.100), 10 CAN (U11.1)
PTA11: 04 MCU_AB (U1.160), 10 CAN (U12.1)
PTA12: 04 MCU_AB (U1.159), 10 CAN (U12.4)
PTA14: 04 MCU_AB (U1.152), 13 HEADERS (J6.1)
PTA24: 04 MCU_AB (U1.14), 05 MCU_C (R155.2)
PTA25: 04 MCU_AB (U1.15), 05 MCU_C (R156.2)
PTA28: 04 MCU_AB (U1.30), 13 HEADERS (J6.4)
PTA29: 04 MCU_AB (U1.32), 13 HEADERS (J6.5)
PTA30: 04 MCU_AB (U1.33), 13 HEADERS (J6.6)
PTB18: 04 MCU_AB (U1.42), 13 HEADERS (J6.3)
PTB22: 04 MCU_AB (U1.67), 12 SWITCH & LED (R143.2)
PTB23: 04 MCU_AB (U1.69), 06 MCU_PORT (R174.1), 13 HEADERS (J5.1)
PTB23/WKPU40: 06 MCU_PORT (R174.2), 12 SWITCH & LED (C90.1 R139.2 SW2.3 SW2.4)
PTB24: 04 MCU_AB (U1.70), 13 HEADERS (J5.2)
PTC4: 04 MCU_AB (U1.166), 08 MCU_LINK_DEBUG (J15.3)
PTC14: 04 MCU_AB (U1.71), 12 SWITCH & LED (R144.2)
PTC15: 04 MCU_AB (U1.68), 13 HEADERS (J6.2)
PTC16: 04 MCU_AB (U1.66), 12 SWITCH & LED (R141.2)
PTC26: 04 MCU_AB (U1.91), CAN1 (U5.4)
PTC27: 04 MCU_AB (U1.93), CAN1 (U5.1)
PTC28: 04 MCU_AB (U1.96), CAN1 (U3.1)
PTC29: 04 MCU_AB (U1.99), CAN1 (U3.4)
PTC30: 04 MCU_AB (U1.101), CAN1 (U4.1)
PTC31: 04 MCU_AB (U1.103), CAN1 (U4.4)
PTD5: 04 MCU_AB (U1.53), 06 MCU_PORT (R218.1)
PTD5/EIRQ13: 06 MCU_PORT (R218.2), 12 SWITCH & LED (C88.1 R140.2 SW3.3 SW3.4)
PTD8: 04 MCU_AB (U1.64), 13 HEADERS (J5.6 R146.2)
PTD9: 04 MCU_AB (U1.63), 13 HEADERS (J5.5 R145.2)
PTD17: 04 MCU_AB (U1.31), 13 HEADERS (J5.3)
PTE3: 05 MCU_C (U1.27), UART (U7.14)
PTE12: 05 MCU_C (U1.29), 13 HEADERS (J5.4)
PTE14: 05 MCU_C (U1.26), UART (U7.15)
PTE24: 05 MCU_C (U1.157), 10 CAN (U13.1)
PTE25: 05 MCU_C (U1.158), 10 CAN (U13.4)